# EAGLE design chanomele_main (EAGLE 6.4)
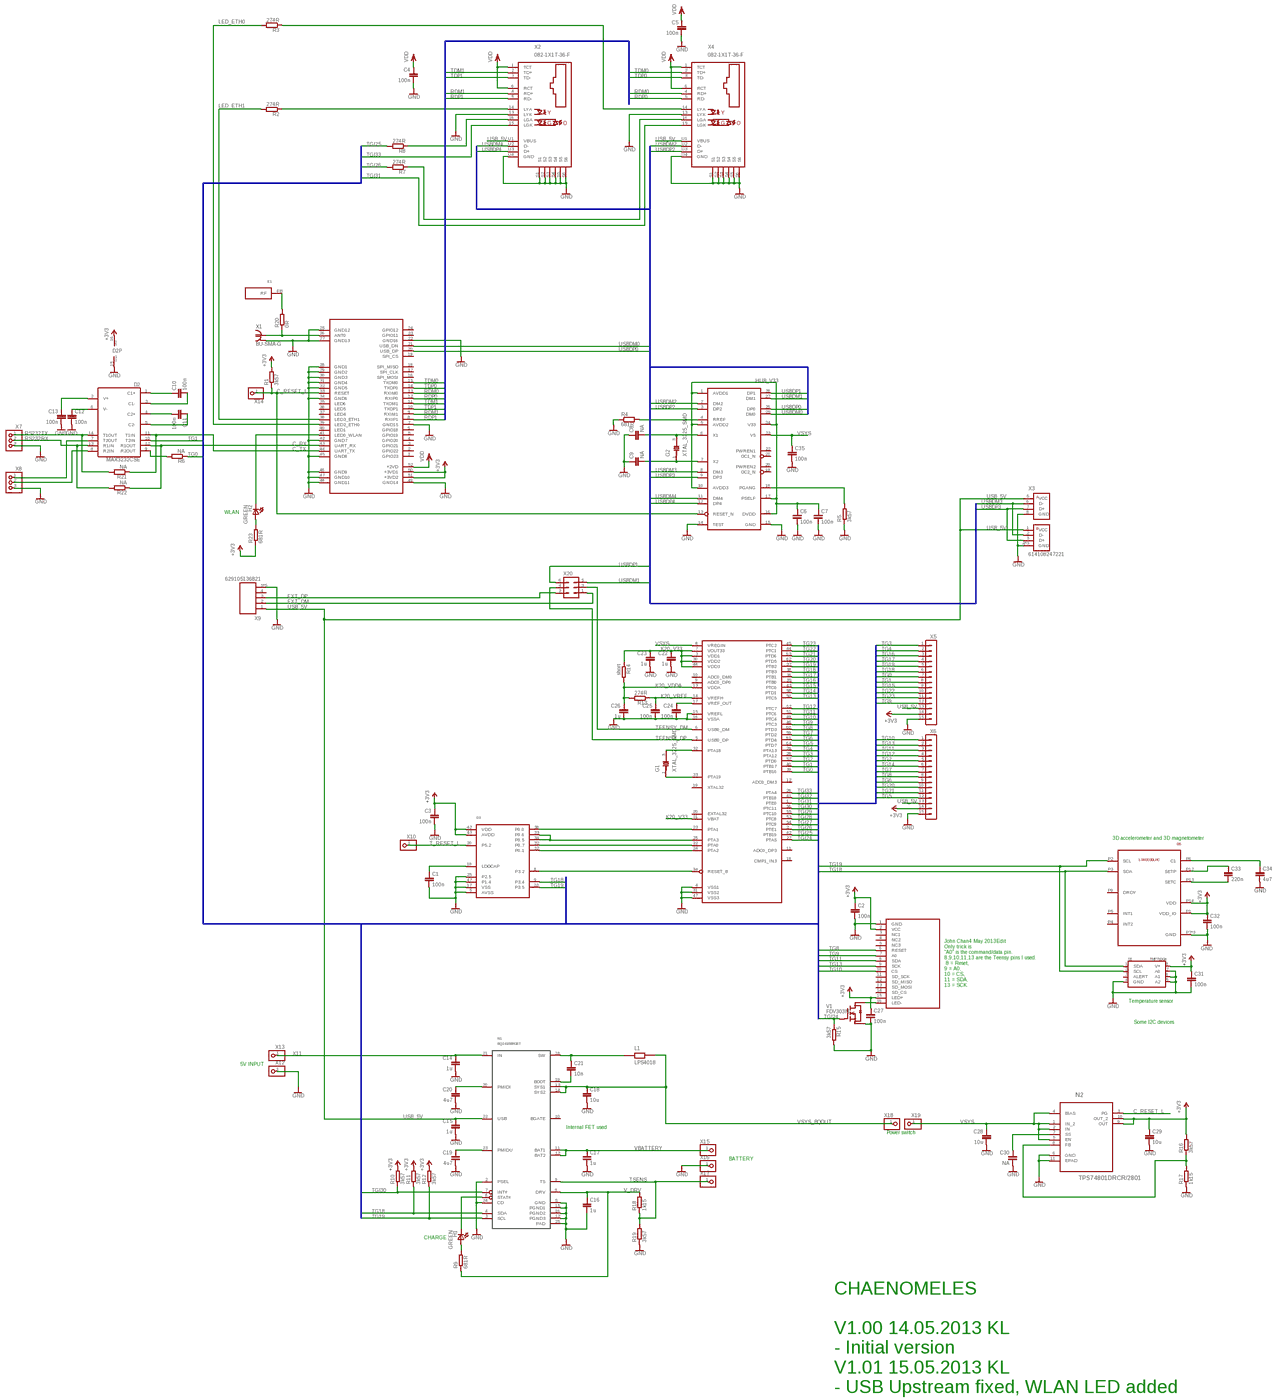
[diagram p0: schematic, sheet 1, overview]
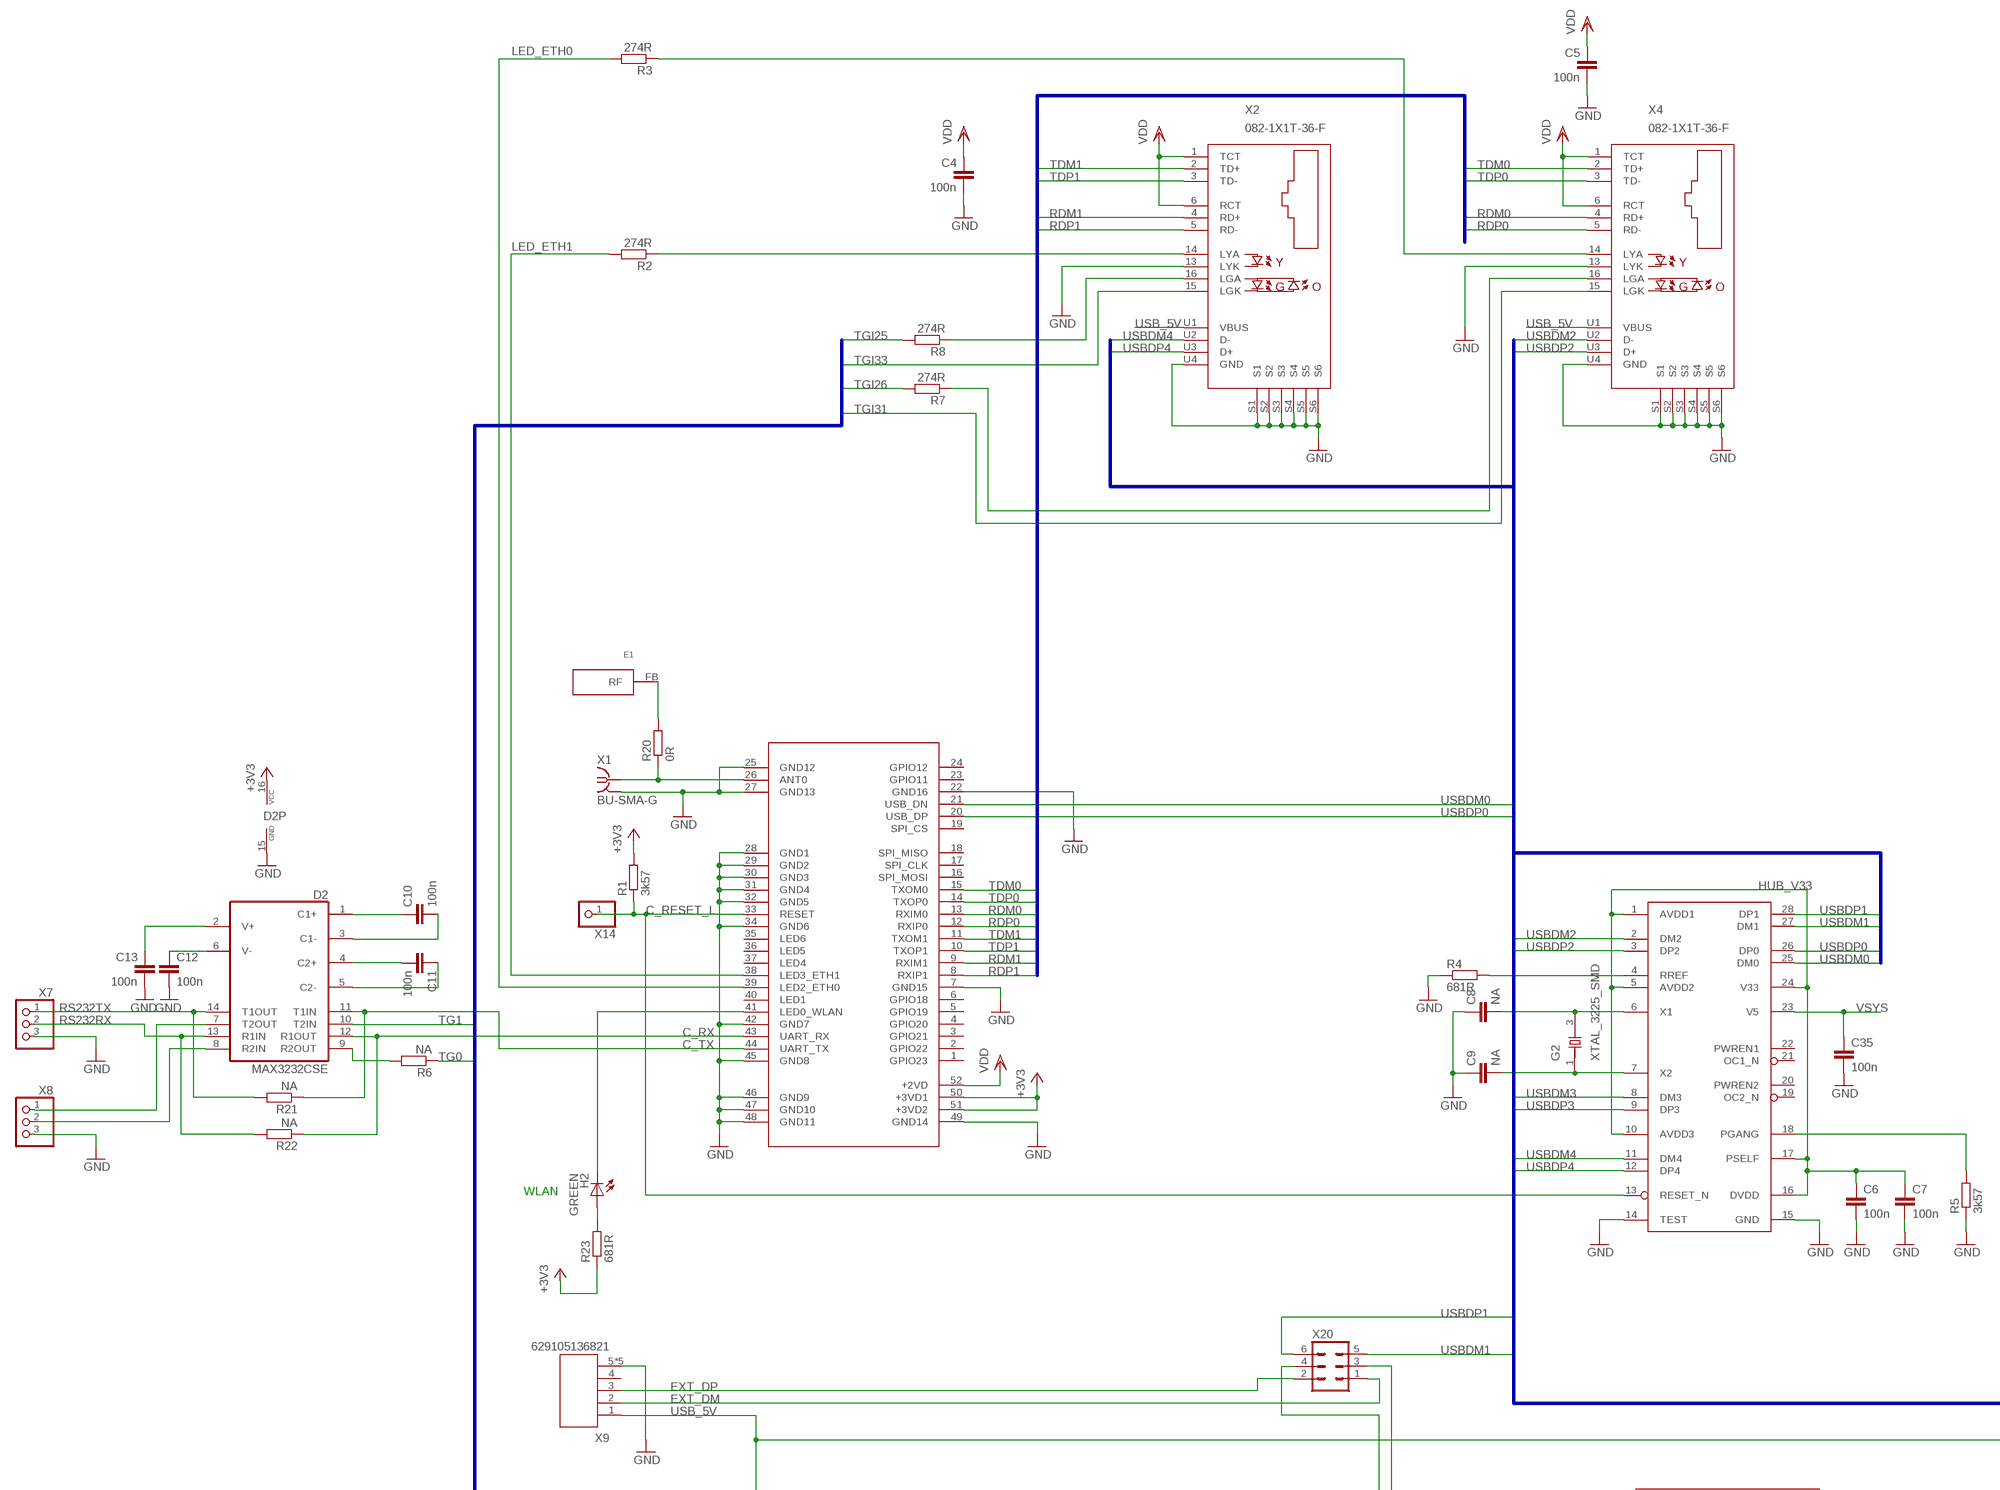
[diagram p1: schematic, sheet 1, part 1 of 4]
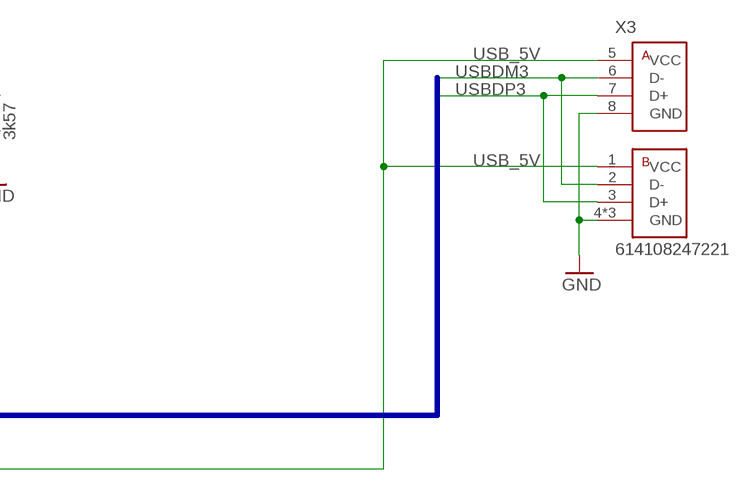
[diagram p2: schematic, sheet 1, part 2 of 4]
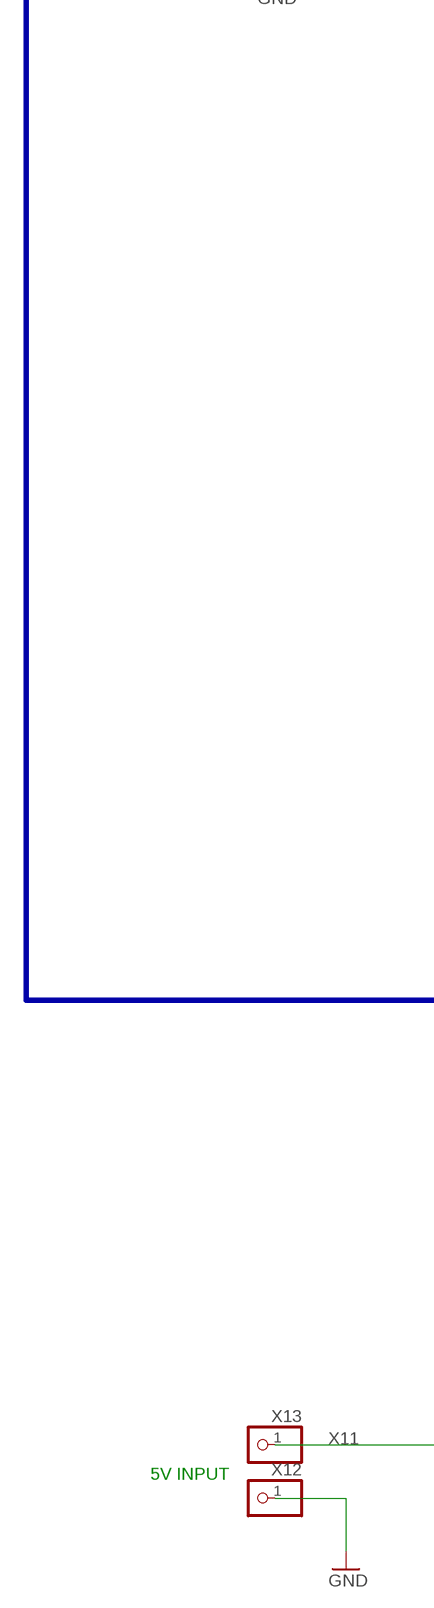
[diagram p3: schematic, sheet 1, part 3 of 4]
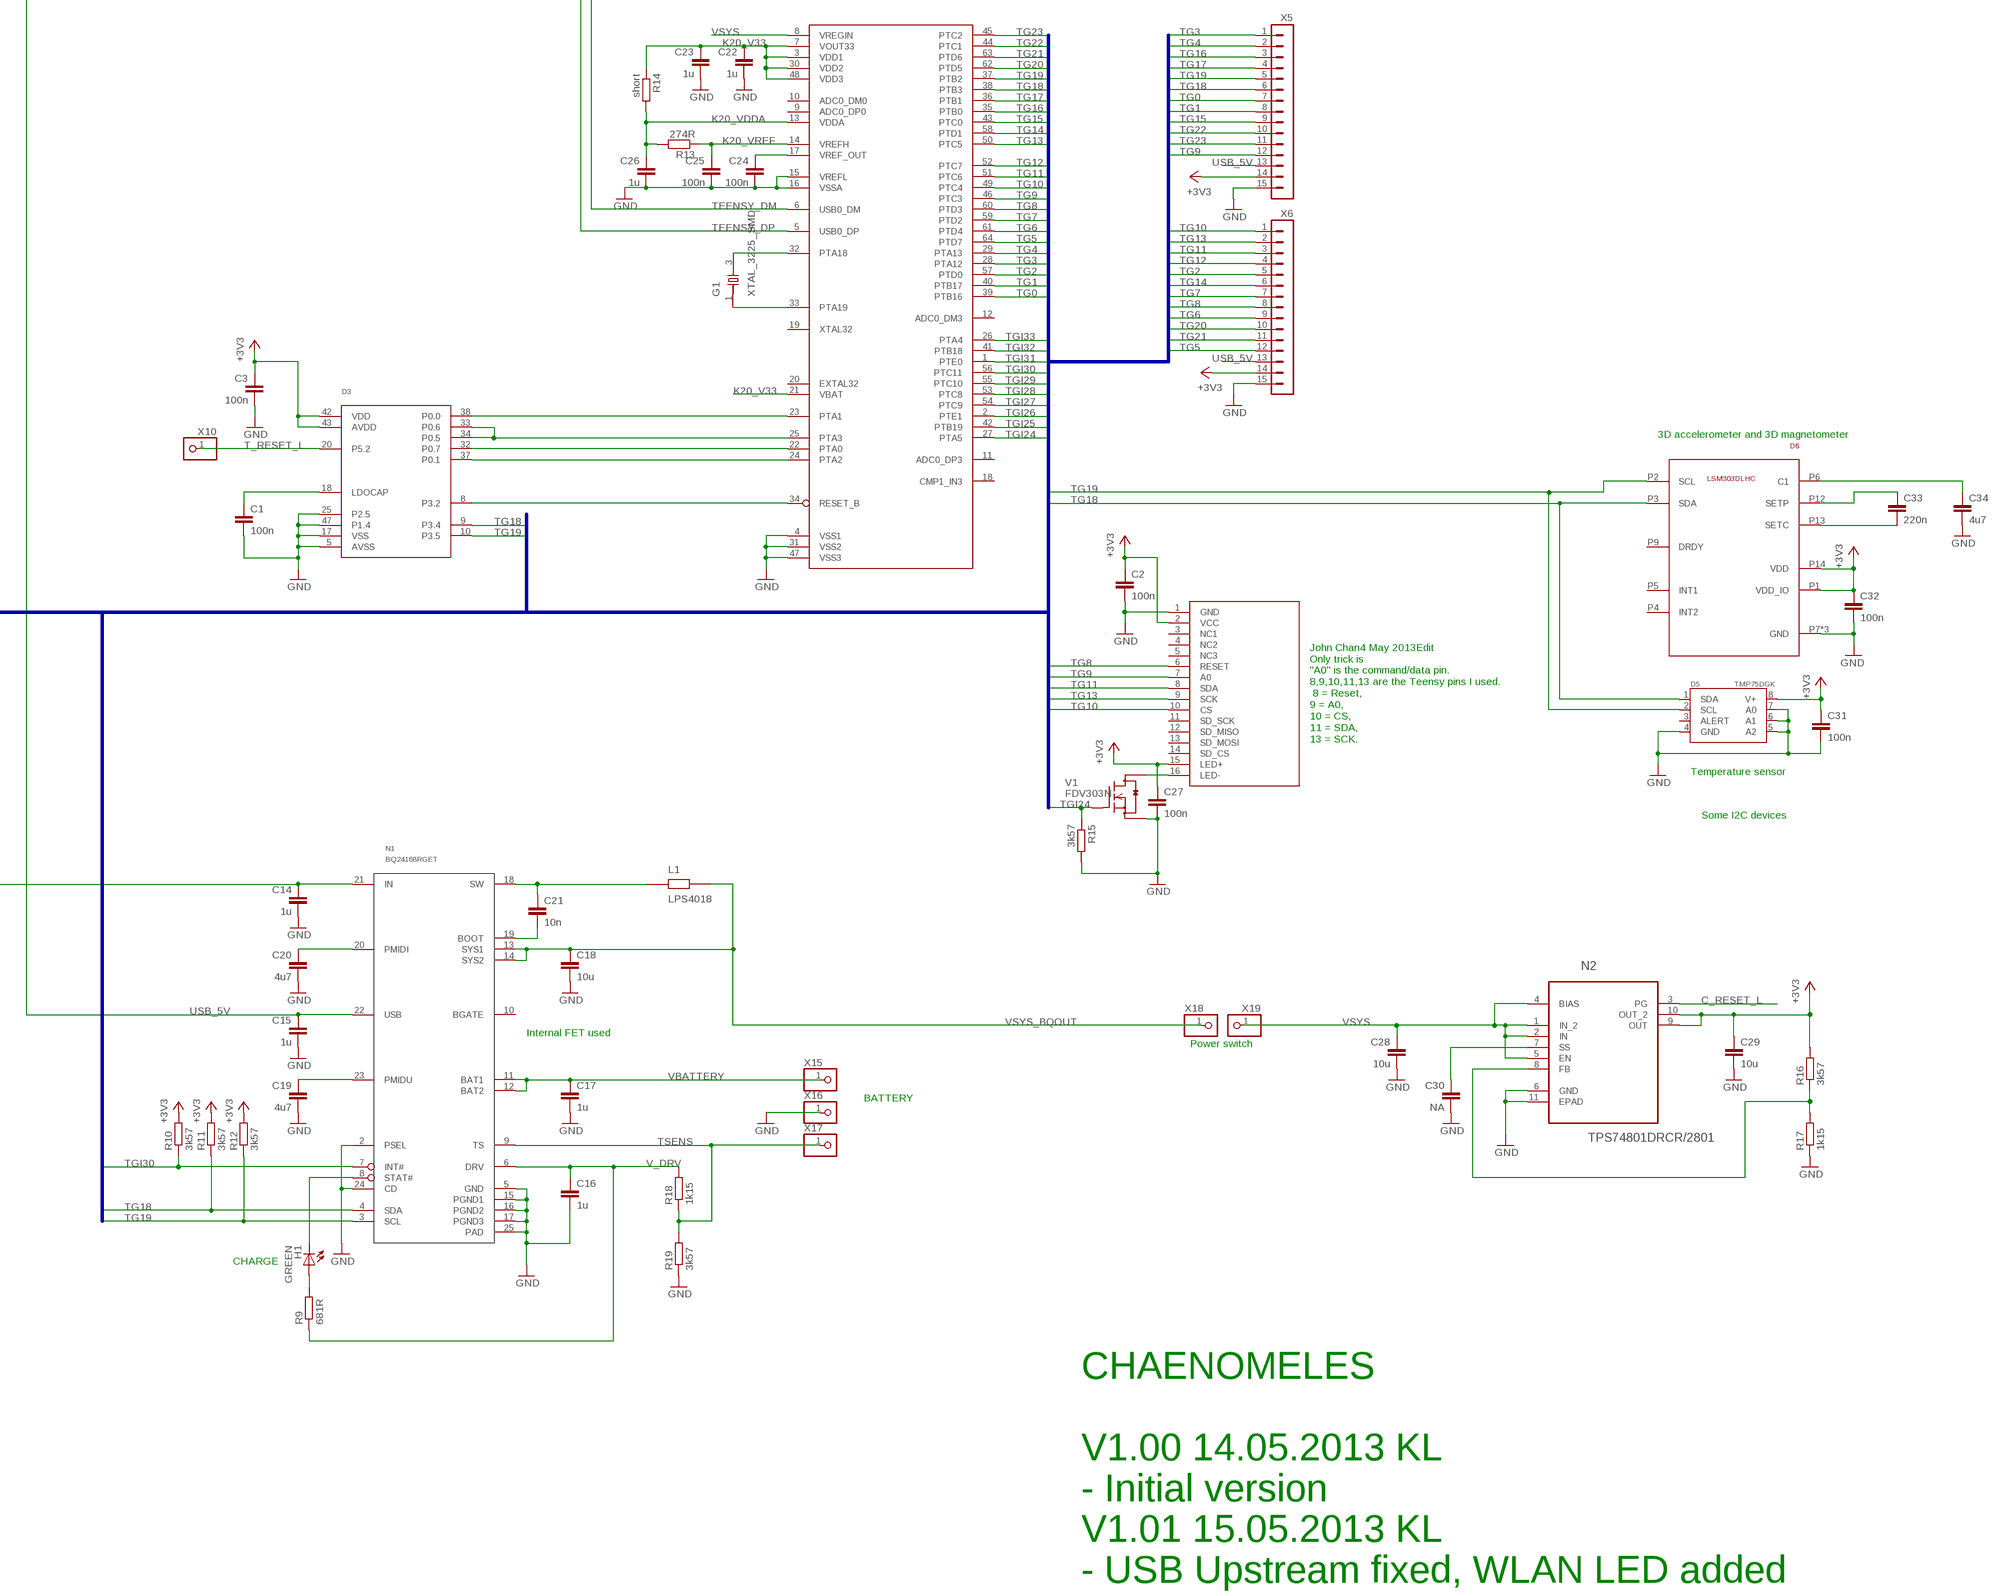
[diagram p4: schematic, sheet 1, part 4 of 4]

## Parts
A1  CARAMBOLA2  [CARAMBOLA1]
A2  TFT18  [TFT18]
C1  100n  C-EUC0402  [C0402]
C2  100n  C-EUC0402  [C0402]
C3  100n  C-EUC0402  [C0402]
C4  100n  C-EUC0402  [C0402]
C5  100n  C-EUC0402  [C0402]
C6  100n  C-EUC0402  [C0402]
C7  100n  C-EUC0402  [C0402]
C8  NA  C-EUC0402  [C0402]
C9  NA  C-EUC0402  [C0402]
C10  100n  C-EUC0402  [C0402]
C11  100n  C-EUC0402  [C0402]
C12  100n  C-EUC0402  [C0402]
C13  100n  C-EUC0402  [C0402]
C14  1u  C-EUC0603  [C0603]
C15  1u  C-EUC0603  [C0603]
C16  1u  C-EUC0603  [C0603]
C17  1u  C-EUC0603  [C0603]
C18  10u  C-EUC0805  [C0805]
C19  4u7  C-EUC0805  [C0805]
C20  4u7  C-EUC0805  [C0805]
C21  10n  C-EUC0402  [C0402]
C22  1u  C-EUC0603  [C0603]
C23  1u  C-EUC0603  [C0603]
C24  100n  C-EUC0402  [C0402]
C25  100n  C-EUC0402  [C0402]
C26  1u  C-EUC0603  [C0603]
C27  100n  C-EUC0402  [C0402]
C28  10u  C-EUC0805  [C0805]
C29  10u  C-EUC0805  [C0805]
C30  NA  C-EUC0402  [C0402]
C31  100n  C-EUC0402  [C0402]
C32  100n  C-EUC0402  [C0402]
C33  220n  C-EUC0402  [C0402]
C34  4u7  C-EUC0805  [C0805]
C35  100n  C-EUC0402  [C0402]
D1  MK20DX128VLH5  [FREESCALE_64_LQFP]
D2  MAX3232CSE  [SO16]
D3  MINI54LAN  [LQFP48-7X7]
D4  GL850G  [SSOP28DB]
D5  TMP75DGK  [MSOP8]
D6  LSM303DLHC  [LGA_3X5X1_14L]
E1  SMD_ANT_2.4GHZ  [2.4GHZ_SMD_ANTENNA]
G1  XTAL_3225_SMD  [X_3225]
G2  XTAL_3225_SMD  [X_3225]
H1  GREEN  LEDCHIP-LED0603  [CHIP-LED0603]
H2  GREEN  LEDCHIP-LED0603  [CHIP-LED0603]
L1  LPS4018  [LPS4018]
N1  BQ24168RGET  [QFN50P400X400X100-25N]
N2  TPS74801DRCR/2801  [SON50P300X300X100-11N]
R1  3k57  R-EU_R0402  [R0402]
R2  274R  R-EU_R0402  [R0402]
R3  274R  R-EU_R0402  [R0402]
R4  681R  R-EU_R0402  [R0402]
R5  3k57  R-EU_R0402  [R0402]
R6  NA  R-EU_R0402  [R0402]
R7  274R  R-EU_R0402  [R0402]
R8  274R  R-EU_R0402  [R0402]
R9  681R  R-EU_R0402  [R0402]
R10  3k57  R-EU_R0402  [R0402]
R11  3k57  R-EU_R0402  [R0402]
R12  3k57  R-EU_R0402  [R0402]
R13  274R  R-EU_R0402  [R0402]
R14  short  R-EU_R0402  [R0402]
R15  3k57  R-EU_R0402  [R0402]
R16  3k57  R-EU_R0402  [R0402]
R17  1k15  R-EU_R0402  [R0402]
R18  1k15  R-EU_R0402  [R0402]
R19  3k57  R-EU_R0402  [R0402]
R20  0R  R-EU_R0402  [R0402]
R21  NA  R-EU_R0402  [R0402]
R22  NA  R-EU_R0402  [R0402]
R23  681R  R-EU_R0402  [R0402]
V1  FDV303N  [SOT23]
X1  BU-SMA-G  [BU-SMA-G]
X2  082-1X1T-36-F  [0821-1X1T-36-F]
X3  614108247221  [614108247221]
X4  082-1X1T-36-F  [0821-1X1T-36-F]
X5  PIIKKIRIMA-15  [PIIKKIRIMA-15]
X6  PIIKKIRIMA-15  [PIIKKIRIMA-15]
X7  PINHD-1X3/90  [1X03/90]
X8  PINHD-1X3/90  [1X03/90]
X9  629105136821  [629105136821]
X10  PINHD-1X1  [1X01]
X12  PINHD-1X1  [1X01]
X13  PINHD-1X1  [1X01]
X14  PINHD-1X1  [1X01]
X15  PINHD-1X1  [1X01]
X16  PINHD-1X1  [1X01]
X17  PINHD-1X1  [1X01]
X18  PINHD-1X1  [1X01]
X19  PINHD-1X1  [1X01]
X20  MA03-2  [MA03-2]

## Nets
+3V3: A1.50(+3VD1) A1.51(+3VD2) A2.2(VCC) A2.15(LED+) C2.1 C3.1 C27.1 C29.1 C31.1 C32.1 D2.16(VCC) D3.42(VDD) D3.43(AVDD) D5.8(V+) D6.P1(VDD_IO) D6.P14(VDD) N2.9(OUT) N2.10(OUT_2) R1.2 R10.2 R11.2 R12.2 R16.2 R23.1 X5.14 X6.14
C_RESET_L: A1.33(RESET) D4.13(RESET_N) N2.3(PG) R1.1 X14.1
C_RX: A1.43(UART_RX) D2.12(R1OUT) R22.1
C_TX: A1.44(UART_TX) D2.11(T1IN) R21.1
EXT_DM: X9.2 X20.1
EXT_DP: X9.3 X20.2
EXTAL: D1.33(PTA19) G1.1(X1)
FEEDBACK: N2.8(FB) R16.1 R17.2
GND: A1.7(GND15) A1.22(GND16) A1.25(GND12) A1.27(GND13) A1.28(GND1) A1.29(GND2) A1.30(GND3) A1.31(GND4) A1.32(GND5) A1.34(GND6) A1.42(GND7) A1.45(GND8) A1.46(GND9) A1.47(GND10) A1.48(GND11) A1.49(GND14) A2.1(GND) C1.2 C2.2 C3.2 C4.2 C5.2 C6.2 C7.2 C8.1 C9.1 C12.2 C13.2 C14.2 C15.2 C16.2 C17.2 C18.2 C19.2 C20.2 C22.2 C23.2 C24.2 C25.2 C26.2 C27.2 C28.2 C29.2 C30.2 C31.2 C32.2 C34.2 C35.2 D1.4(VSS1) D1.15(VREFL) D1.16(VSSA) D1.31(VSS2) D1.47(VSS3) D2.15(GND) D3.5(AVSS) D3.17(VSS) D3.25(P2.5) D3.47(P1.4) D4.14(TEST) D4.15(GND) D5.4(GND) D5.5(A2) D5.6(A1) D5.7(A0) D6.P7(GND) D6.P10(GND) D6.P11(GND) N1.2(PSEL) N1.5(GND) N1.15(PGND1) N1.16(PGND2) N1.17(PGND3) N1.24(CD) N1.25(PAD) N2.6(GND) N2.11(EPAD) R4.1 R5.1 R15.2 R17.1 R19.1 V1.2(S) X1.2 X1.3 X1.4 X1.5 X2.13(LYK) X2.S1 X2.S2 X2.S3 X2.S4 X2.S5 X2.S6 X2.U4(GND) X3.4(GND) X3.8(GND) X3.P$1(GND) X3.P$2(GND) X4.13(LYK) X4.S1 X4.S2 X4.S3 X4.S4 X4.S5 X4.S6 X4.U4(GND) X5.15 X6.15 X7.3 X8.3 X9.5 X9.Z1 X9.Z2 X9.Z3 X9.Z4 X12.1 X16.1
HUB_V33: C6.1 C7.1 D4.1(AVDD1) D4.5(AVDD2) D4.10(AVDD3) D4.16(DVDD) D4.17(PSELF) D4.24(V33)
K20_V33: C22.1 C23.1 D1.3(VDD1) D1.7(VOUT33) D1.21(VBAT) D1.30(VDD2) D1.48(VDD3) R14.1
K20_VDDA: C26.1 D1.13(VDDA) R13.2 R14.2
K20_VREF: C25.1 D1.14(VREFH) R13.1
LED_ETH0: A1.39(LED2_ETH0) R3.2
LED_ETH1: A1.38(LED3_ETH1) R2.2
LED_WLAN: A1.41(LED0_WLAN) H2.C
N$1: D1.23(PTA1) D3.38(P0.0)
N$2: D1.25(PTA3) D3.33(P0.6) D3.34(P0.5)
N$3: A1.26(ANT0) R20.1 X1.1
N$4: C8.2 D4.6(X1) G2.3(X2)
N$5: C9.2 D4.7(X2) G2.1(X1)
N$6: E1.FB(RF) R20.2
N$8: D1.22(PTA0) D3.32(P0.7)
N$9: D1.24(PTA2) D3.37(P0.1)
N$10: D1.34(RESET_B) D3.8(P3.2)
N$11: C1.1 D3.18(LDOCAP)
N$13: R2.1 X2.14(LYA)
N$15: R3.1 X4.14(LYA)
N$16: H2.A R23.2
N$17: D4.18(PGANG) R5.2
N$18: C12.1 D2.6(V-)
N$19: C13.1 D2.2(V+)
N$20: C10.1 D2.1(C1+)
N$21: C10.2 D2.3(C1-)
N$22: C11.1 D2.5(C2-)
N$23: C11.2 D2.4(C2+)
N$24: D2.7(T2OUT) X8.1
N$25: D2.8(R2IN) X8.2
N$26: D2.9(R2OUT) R6.2
N$27: R7.1 X4.16(LGA)
N$28: R8.1 X2.16(LGA)
N$30: C20.1 N1.20(PMIDI)
N$32: C19.1 N1.23(PMIDU)
N$34: C21.2 N1.19(BOOT)
N$35: C24.1 D1.17(VREF_OUT)
N$37: C21.1 L1.A N1.18(SW)
N$38: H1.C N1.8(STAT#)
N$39: H1.A R9.2
N$57: A2.16(LED-) V1.3(D)
N$59: C34.1 D6.P6(C1)
N$60: C33.2 D6.P13(SETC)
N$61: C33.1 D6.P12(SETP)
RDM0: A1.13(RXIM0) X4.4(RD+)
RDM1: A1.9(RXIM1) X2.4(RD+)
RDP0: A1.12(RXIP0) X4.5(RD-)
RDP1: A1.8(RXIP1) X2.5(RD-)
RS232RX: D2.13(R1IN) R22.2 X7.2
RS232TX: D2.14(T1OUT) R21.2 X7.1
SS: C30.1 N2.7(SS)
T_RESET_L: D3.20(P5.2) X10.1
TDM0: A1.15(TXOM0) X4.2(TD+)
TDM1: A1.11(TXOM1) X2.2(TD+)
TDP0: A1.14(TXOP0) X4.3(TD-)
TDP1: A1.10(TXOP1) X2.3(TD-)
TEENSY_DM: D1.6(USB0_DM) X20.3
TEENSY_DP: D1.5(USB0_DP) X20.4
TG0: D1.39(PTB16) R6.1 X5.7
TG1: D1.40(PTB17) D2.10(T2IN) X5.8
TG2: D1.57(PTD0) X6.5
TG3: D1.28(PTA12) X5.1
TG4: D1.29(PTA13) X5.2
TG5: D1.64(PTD7) X6.12
TG6: D1.61(PTD4) X6.9
TG7: D1.59(PTD2) X6.7
TG8: A2.6(RESET) D1.60(PTD3) X6.8
TG9: A2.7(A0) D1.46(PTC3) X5.12
TG10: A2.10(CS) D1.49(PTC4) X6.1
TG11: A2.8(SDA) D1.51(PTC6) X6.3
TG12: D1.52(PTC7) X6.4
TG13: A2.9(SCK) D1.50(PTC5) X6.2
TG14: D1.58(PTD1) X6.6
TG15: D1.43(PTC0) X5.9
TG16: D1.35(PTB0) X5.3
TG17: D1.36(PTB1) X5.4
TG18: D1.38(PTB3) D3.9(P3.4) D5.1(SDA) D6.P3(SDA) N1.4(SDA) R11.1 X5.6
TG19: D1.37(PTB2) D3.10(P3.5) D5.2(SCL) D6.P2(SCL) N1.3(SCL) R12.1 X5.5
TG20: D1.62(PTD5) X6.10
TG21: D1.63(PTD6) X6.11
TG22: D1.44(PTC1) X5.10
TG23: D1.45(PTC2) X5.11
TGI24: D1.27(PTA5) R15.1 V1.1(G)
TGI25: D1.42(PTB19) R8.2
TGI26: D1.2(PTE1) R7.2
TGI27: D1.54(PTC9)
TGI28: D1.53(PTC8)
TGI29: D1.55(PTC10)
TGI30: D1.56(PTC11) N1.7(INT#) R10.1
TGI31: D1.1(PTE0) X4.15(LGK)
TGI32: D1.41(PTB18)
TGI33: D1.26(PTA4) X2.15(LGK)
TSENS: N1.9(TS) R18.1 R19.2 X17.1
USB_5V: C15.1 N1.22(USB) X2.U1(VBUS) X3.1(VCC) X3.5(VCC) X4.U1(VBUS) X5.13 X6.13 X9.1
USBDM0: A1.21(USB_DN) D4.25(DM0)
USBDM1: D4.27(DM1) X20.5
USBDM2: D4.2(DM2) X4.U2(D-)
USBDM3: D4.8(DM3) X3.2(D-) X3.6(D-)
USBDM4: D4.11(DM4) X2.U2(D-)
USBDP0: A1.20(USB_DP) D4.26(DP0)
USBDP1: D4.28(DP1) X20.6
USBDP2: D4.3(DP2) X4.U3(D+)
USBDP3: D4.9(DP3) X3.3(D+) X3.7(D+)
USBDP4: D4.12(DP4) X2.U3(D+)
USBREF: D4.4(RREF) R4.2
V_DRV: C16.1 N1.6(DRV) R9.1 R18.2
VBATTERY: C17.1 N1.11(BAT1) N1.12(BAT2) X15.1
VDD [VDD]: A1.52(+2VD) C4.1 C5.1 X2.1(TCT) X2.6(RCT) X4.1(TCT) X4.6(RCT)
VSYS: C28.1 C35.1 D1.8(VREGIN) D4.23(V5) N2.1(IN_2) N2.2(IN) N2.4(BIAS) N2.5(EN) X19.1
VSYS_BQOUT: C18.1 L1.B N1.13(SYS1) N1.14(SYS2) X18.1
X11: C14.1 N1.21(IN) X13.1
XTAL: D1.32(PTA18) G1.3(X2)
Unconnected: A1.1(GPIO23) A1.2(GPIO22) A1.3(GPIO21) A1.4(GPIO20) A1.5(GPIO19) A1.6(GPIO18) A1.16(SPI_MOSI) A1.17(SPI_CLK) A1.18(SPI_MISO) A1.19(SPI_CS) A1.23(GPIO11) A1.24(GPIO12) A1.35(LED6) A1.36(LED5) A1.37(LED4) A1.40(LED1) A2.3(NC1) A2.4(NC2) A2.5(NC3) A2.11(SD_SCK) A2.12(SD_MISO) A2.13(SD_MOSI) A2.14(SD_CS) D1.9(ADC0_DP0) D1.10(ADC0_DM0) D1.11(ADC0_DP3) D1.12(ADC0_DM3) D1.18(CMP1_IN3) D1.19(XTAL32) D1.20(EXTAL32) D4.19(OC2_N) D4.20(PWREN2) D4.21(OC1_N) D4.22(PWREN1) D5.3(ALERT) D6.P4(INT2) D6.P5(INT1) D6.P9(DRDY) N1.10(BGATE) X9.4

## Buses
USBDP[0..4],USBDM[0..4]
TDP0,TDM0,RDP0,RDM0,TDP1,TDM1,RDP1,RDM1
TG[0..23],TGI[24..33]

## Notes on the sheet
- WLAN
- 3D accelerometer and 3D magnetometer
- John Chan4 May 2013Edit
  Only trick is 
  "A0" is the command/data pin. 
  8,9,10,11,13 are the Teensy pins I used.
   8 = Reset, 
  9 = A0, 
  10 = CS, 
  11 = SDA, 
  13 = SCK.
- Temperature sensor
- Some I2C devices
- 5V INPUT
- Internal FET used
- Power switch
- BATTERY
- CHARGE
- CHAENOMELES
  
  V1.00 14.05.2013 KL
  - Initial version
  V1.01 15.05.2013 KL
  - USB Upstream fixed, WLAN LED added

## Library data of the parts
A1 = OMAT_IC:CARAMBOLA2
A2 = OMAT_IC:TFT18
C1-C35 = rcl:C-EU: CAPACITOR, European symbol
D1 = OMAT_IC:MK20DX128VLH5
D2 = maxim:MAX3232*: True RS-232 Transceivers 3.0V to 5.5V, Low-Power up to 1Mbps, Using Four 0.1µF External Capacitors Source: http://pdfserv.maxim-ic.com/en/ds/MAX3222-MAX3241.pdf; MPN: MAX3232CSE; OC_FARNELL: 9725490; OC_NEWARK: 90C2890
D3 = OMAT_IC:MINI54LAN
D4 = OMAT_IC:GL850G
D5 = ti_tmp:TMP75
D6 = sensors:LSM303DLHC
E1 = OMAT_IC:SMD_ANT_2.4GHZ
G1 G2 = OMAT_IC:XTAL_3225_SMD: CRYSTAL CLOCK OSCILLATORS 5.0 Vdc or 3.3 Vdc - LOW PROFILE ULTRA MINIATURE CERAMIC SURFACE MOUNT Source: http://www.abracon.com/Oscillators/asf1-L-L1.pdf
H1 H2 = led:LED: LED OSRAM: - CHIPLED LG R971, LG N971, LY N971, LG Q971, LY Q971, LO R971, LY R971 LH N974, LH R974 LS Q976, LO Q976, LY Q976 LO Q996 - Hyper CHIPLED LW Q18S LB Q993, LB Q99A, LB R99A - SideLED LS A670, LO A670, LY A670, LG A670, LP A670 LB A673, LV A673, LT A673, LW A673 LH A674 LY A675 LS A676, LA A676, LO A676, LY A676, LW A676 LS A679, LY A679, LG A679 - Hyper Micro SIDELED® LS Y876, LA Y876, LO Y876, LY Y876 LT Y87S - SmartLED LW L88C, LW L88S LB L89C, LB L89S, LG L890 LS L89K, LO L89K, LY L89K LS L896, LA L896, LO L896, LY L896 - TOPLED LS T670, LO T670, LY T670, LG T670, LP T670 LSG T670, LSP T670, LSY T670, LOP T670, LYG T670 LG T671, LOG T671, LSG T671 LB T673, LV T673, LT T673, LW T673 LH T674 LS T676, LA T676, LO T676, LY T676, LB T676, LH T676, LSB T676, LW T676 LB T67C, LV T67C, LT T67C, LS T67K, LO T67K, LY T67K, LW E67C LS E67B, LA E67B, LO E67B, LY E67B, LB E67C, LV E67C, LT E67C LW T67C LS T679, LY T679, LG T679 LS T770, LO T770, LY T770, LG T770, LP T770 LB T773, LV T773, LT T773, LW T773 LH T774 LS E675, LA E675, LY E675, LS T675 LS T776, LA T776, LO T776, LY T776, LB T776 LHGB T686 LT T68C, LB T68C - Hyper Mini TOPLED® LB M676 - Mini TOPLED Santana® LG M470 LS M47K, LO M47K, LY M47K Source: http://www.osram.convergy.de LUXEON: - LUMILED® LXK2-PW12-R00, LXK2-PW12-S00, LXK2-PW14-U00, LXK2-PW14-V00 LXK2-PM12-R00, LXK2-PM12-S00, LXK2-PM14-U00 LXK2-PE12-Q00, LXK2-PE12-R00, LXK2-PE12-S00, LXK2-PE14-T00, LXK2-PE14-U00 LXK2-PB12-K00, LXK2-PB12-L00, LXK2-PB12-M00, LXK2-PB14-N00, LXK2-PB14-P00, LXK2-PB14-Q00 LXK2-PR12-L00, LXK2-PR12-M00, LXK2-PR14-Q00, LXK2-PR14-R00 LXK2-PD12-Q00, LXK2-PD12-R00, LXK2-PD12-S00 LXK2-PH12-R00, LXK2-PH12-S00 LXK2-PL12-P00, LXK2-PL12-Q00, LXK2-PL12-R00 Source: www.luxeon.com KINGBRIGHT: KA-3528ASYC Source: www.kingbright.com
L1 = OMAT_IC:LPS4018: Coilcraft Shielded SMT power inductor 15uH inductor for LM2842 switching regulator application circuit.; DATASHEET: http://www.coilcraft.com/pdf_viewer/showpdf.cfm?f=pdf_store:lps4018.pdf; LINK: http://www.coilcraft.com/lps4018.cfm; MFGPN: LPS4018-153MLB
N1 = OMAT_IC:BQ24168RGET
N2 = Texas Instruments_By_element14_Batch_1:TPS74801DRCR/2801: 1.5A Low-Dropout Linear Regulator with Programmable Soft-Start; MPN: TPS74801DRCR/2801; OC_FARNELL: -; OC_NEWARK: 55R7658; PACKAGE: SON-10; SUPPLIER: Texas Instruments
R1-R23 = rcl:R-EU_: RESISTOR, European symbol
V1 = fairchild:FDV303N
X1 = con-coax:BU-SMA-G: FEMALE SMA CONNECTOR Radiall distributor RS 193-9117; OC_FARNELL: unknown; OC_NEWARK: unknown
X2 X4 = OMAT_IC:082-1X1T-36-F: Ethernet Connector MagJack (R) Source: www.stewartconnector.com .. si-50170.pdf; OC_FARNELL: unknown; OC_NEWARK: unknown
X3 = OMAT_IC:614108247221: WR-COM USB Dual way Horizontal Type A
X5 X6 = OMAT_IC:PIIKKIRIMA-15: PIN HEADER; OC_FARNELL: unknown; OC_NEWARK: unknown
X7 X8 = pinhead:PINHD-1X3: PIN HEADER
X9 = OMAT_IC:629105136821: WR-COM SMT Horizontal 5 Contacts Micro USB Type B,5 pins
X10 X12-X19 = pinhead:PINHD-1X1: PIN HEADER
X20 = con-lstb:MA03-2: PIN HEADER; OC_FARNELL: unknown; OC_NEWARK: unknown

## Net classes
1 VDD: width 0.75 mm, drill 0.3 mm, clearance 0.15 mm

## Board
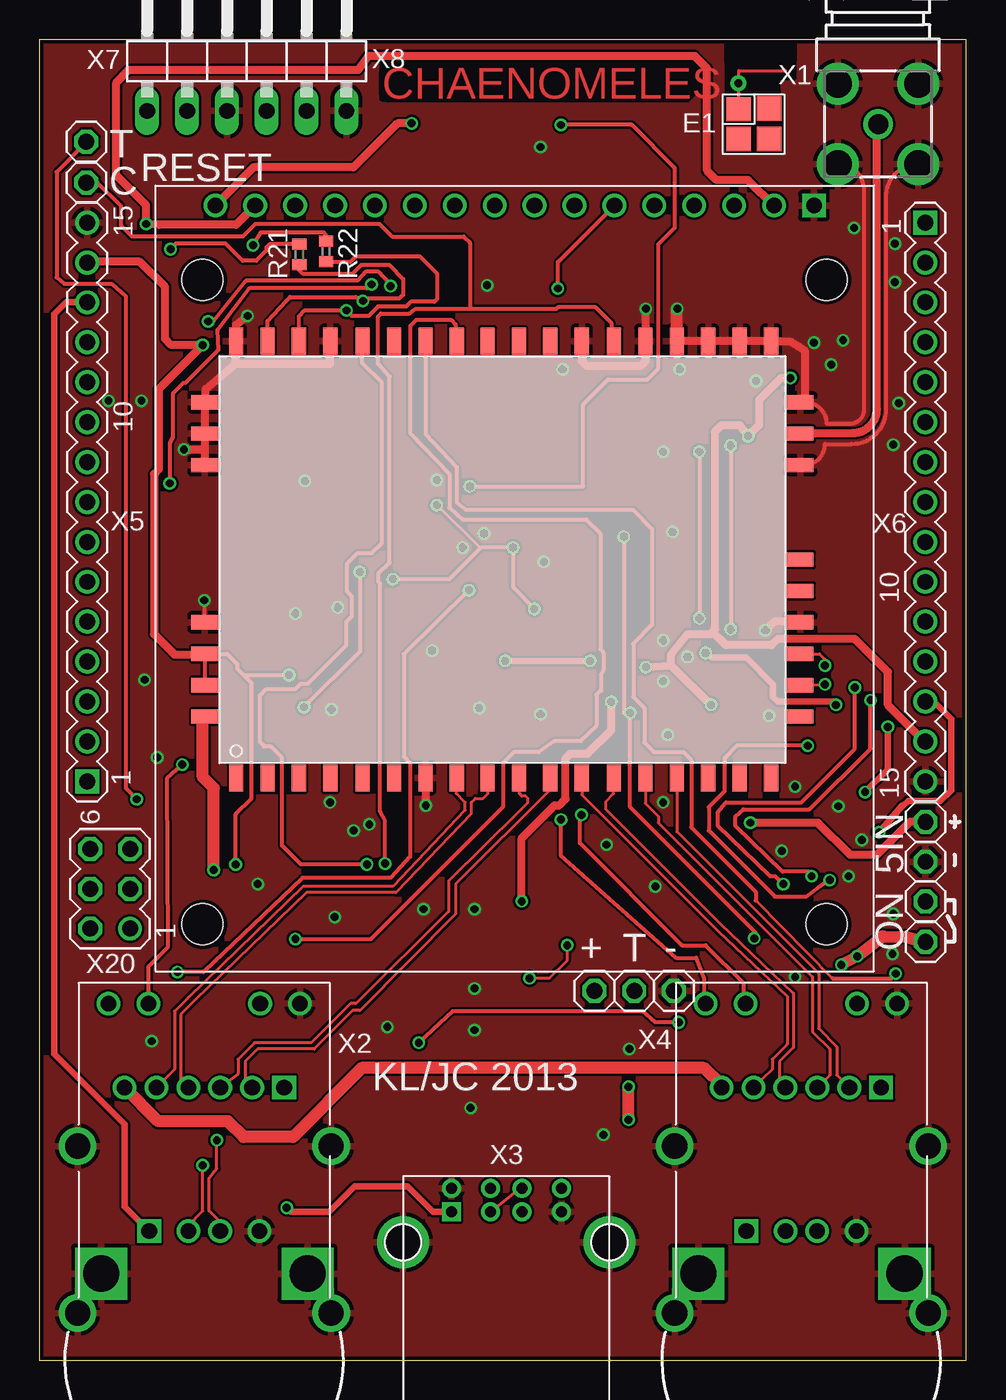
[diagram p5: board, top side]
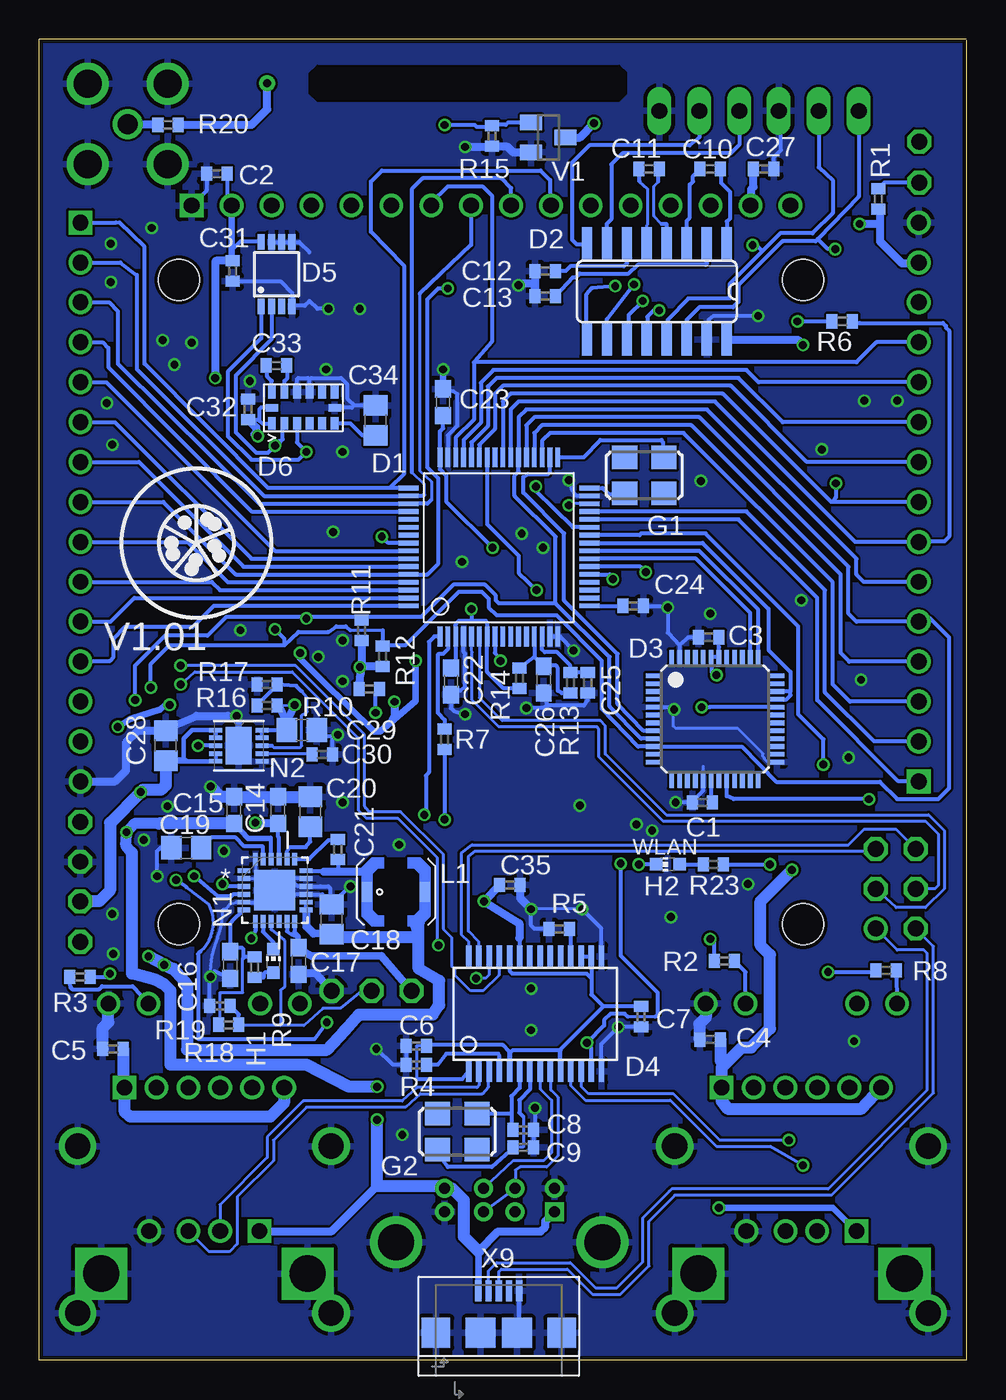
[diagram p6: board, bottom side, seen from below]

Size 59 x 84.05 mm. Coordinates in mm from the lower left corner, seen from the top.
Outline: 0,84 0,0 59,0 59,84.05 0,84.05
Copper layers (1*16): Top 0.035mm / dielectric 1.5mm / Bottom 0.035mm
Design rules "ITEADstudio_DRC": minimum track width 6mil, minimum drill 12mil, track to track 6mil, track to pad 6mil, pad to pad 6mil, via to via 6mil, smd to smd 0mil, copper to edge 10mil, drill to drill 10mil, minimum pad ring 10mil, minimum via ring 6mil, stop-mask expansion 2mil, vias tented up to drill 100mil, thermal gap 10mil
tRestrict: area 21.7,80.2 to 41.8,82.3; 5 lines
bRestrict: area 21.7,80.2 to 41.8,82.3

### Footprints (pad centres in the part's own frame; a part is rotated, then mirrored left to right if it is on the bottom)
CARAMBOLA1 = smd 0.9 x 1.7: 1 2,-23.9; 2 4,-23.9; 3 6,-23.9; 4 8,-23.9; 5 10.05,-23.9; 6 12.05,-23.9; 7 14.05,-23.9; 8 16.05,-23.9; 9 18,-23.9; 10 20,-23.9; 11 22,-23.9; 12 24,-23.9; 13 26.05,-23.9; 14 28.05,-23.9; 15 30.05,-23.9; 16 32.05,-23.9; 17 34.05,-23.9; 18 36.05,-23.9; 28 36.05,3.9; 29 34.05,3.9; 30 32.05,3.9; 31 30.05,3.9; 32 28.05,3.9; 33 26.05,3.9; 34 24,3.9; 35 22,3.9; 36 20,3.9; 37 18,3.9; 38 16.05,3.9; 39 14.05,3.9; 40 12.05,3.9; 41 10.05,3.9; 42 8,3.9; 43 6,3.9; 44 4,3.9; 45 2,3.9 | smd 1.7 x 0.9: 19 37.9,-20; 20 37.9,-18; 21 37.9,-16; 22 37.9,-14; 23 37.9,-12; 24 37.9,-10; 25 37.9,-4; 26 37.9,-2; 27 37.9,0; 46 0,0; 47 0,-2; 48 0,-4; 49 0,-14; 50 0,-16; 51 0,-18; 52 0,-20
TFT18 = drill 1 square: 1 -10.16,-5.08 | drill 1: 2 -7.62,-5.08; 3 -5.08,-5.08; 4 -2.54,-5.08; 5 0,-5.08; 6 2.54,-5.08; 7 5.08,-5.08; 8 7.62,-5.08; 9 10.16,-5.08; 10 12.7,-5.08; 11 15.24,-5.08; 12 17.78,-5.08; 13 20.32,-5.08; 14 22.86,-5.08; 15 25.4,-5.08; 16 27.94,-5.08 | hole 2.6: -10.97,-0.35; 28.75,-0.35; -10.97,40.65; 28.75,40.65
C0402 = smd 0.7 x 0.9: 1 -0.65,0; 2 0.65,0
C0603 = smd 1.1 x 1: 1 -0.85,0; 2 0.85,0
C0805 = smd 1.3 x 1.5: 1 -0.95,0; 2 0.95,0
FREESCALE_64_LQFP = smd 1.27 x 0.3: 1 -15.9,9; 2 -15.9,8.5; 3 -15.9,8; 4 -15.9,7.5; 5 -15.9,7; 6 -15.9,6.5; 7 -15.9,6; 8 -15.9,5.5; 9 -15.9,5; 10 -15.9,4.5; 11 -15.9,4; 12 -15.9,3.5; 13 -15.9,3; 14 -15.9,2.5; 15 -15.9,2; 16 -15.9,1.5; 33 -4.5,1.5; 34 -4.5,2; 35 -4.5,2.5; 36 -4.5,3; 37 -4.5,3.5; 38 -4.5,4; 39 -4.5,4.5; 40 -4.5,5; 41 -4.5,5.5; 42 -4.5,6; 43 -4.5,6.5; 44 -4.5,7; 45 -4.5,7.5; 46 -4.5,8; 47 -4.5,8.5; 48 -4.5,9 | smd 0.3 x 1.27: 17 -13.95,-0.5; 18 -13.45,-0.5; 19 -12.95,-0.5; 20 -12.45,-0.5; 21 -11.95,-0.5; 22 -11.45,-0.5; 23 -10.95,-0.5; 24 -10.45,-0.5; 25 -9.95,-0.5; 26 -9.45,-0.5; 27 -8.95,-0.5; 28 -8.45,-0.5; 29 -7.95,-0.5; 30 -7.45,-0.5; 31 -6.95,-0.5; 32 -6.45,-0.5; 49 -6.45,11; 50 -6.95,11; 51 -7.45,11; 52 -7.95,11; 53 -8.45,11; 54 -8.95,11; 55 -9.45,11; 56 -9.95,11; 57 -10.45,11; 58 -10.95,11; 59 -11.45,11; 60 -11.95,11; 61 -12.45,11; 62 -12.95,11; 63 -13.45,11; 64 -13.95,11
SO16 = smd 0.66 x 2.032: 1 -4.445,-3.073; 2 -3.175,-3.073; 3 -1.905,-3.073; 4 -0.635,-3.073; 5 0.635,-3.073; 6 1.905,-3.073; 7 3.175,-3.073; 8 4.445,-3.073; 9 4.445,3.073; 10 3.175,3.073; 11 1.905,3.073; 12 0.635,3.073; 13 -0.635,3.073; 14 -1.905,3.073; 15 -3.175,3.073; 16 -4.445,3.073
LQFP48-7X7 = smd 0.9 x 0.3: 1 -3.95,2.75; 2 -3.95,2.25; 3 -3.95,1.75; 4 -3.95,1.25; 5 -3.95,0.75; 6 -3.95,0.25; 7 -3.95,-0.25; 8 -3.95,-0.75; 9 -3.95,-1.25; 10 -3.95,-1.75; 11 -3.95,-2.25; 12 -3.95,-2.75; 25 3.95,-2.75; 26 3.95,-2.25; 27 3.95,-1.75; 28 3.95,-1.25; 29 3.95,-0.75; 30 3.95,-0.25; 31 3.95,0.25; 32 3.95,0.75; 33 3.95,1.25; 34 3.95,1.75; 35 3.95,2.25; 36 3.95,2.75 | smd 0.3 x 0.9: 13 -2.75,-3.95; 14 -2.25,-3.95; 15 -1.75,-3.95; 16 -1.25,-3.95; 17 -0.75,-3.95; 18 -0.25,-3.95; 19 0.25,-3.95; 20 0.75,-3.95; 21 1.25,-3.95; 22 1.75,-3.95; 23 2.25,-3.95; 24 2.75,-3.95; 37 2.75,3.95; 38 2.25,3.95; 39 1.75,3.95; 40 1.25,3.95; 41 0.75,3.95; 42 0.25,3.95; 43 -0.25,3.95; 44 -0.75,3.95; 45 -1.25,3.95; 46 -1.75,3.95; 47 -2.25,3.95; 48 -2.75,3.95
SSOP28DB = smd 0.348 x 1.397: 1 -4.225,-3.656; 2 -3.575,-3.656; 3 -2.925,-3.656; 4 -2.275,-3.656; 5 -1.625,-3.656; 6 -0.975,-3.656; 7 -0.325,-3.656; 8 0.325,-3.656; 9 0.975,-3.656; 10 1.625,-3.656; 11 2.275,-3.656; 12 2.925,-3.656; 13 3.575,-3.656; 14 4.225,-3.656; 15 4.225,3.656; 16 3.575,3.656; 17 2.925,3.656; 18 2.275,3.656; 19 1.625,3.656; 20 0.975,3.656; 21 0.325,3.656; 22 -0.325,3.656; 23 -0.975,3.656; 24 -1.625,3.656; 25 -2.275,3.656; 26 -2.925,3.656; 27 -3.575,3.656; 28 -4.225,3.656
MSOP8 = smd 0.45 x 1: 1 -0.975,-2.05; 2 -0.325,-2.05; 3 0.325,-2.05; 4 0.975,-2.05; 5 0.975,2.05; 6 0.325,2.05; 7 -0.325,2.05; 8 -0.975,2.05
LGA_3X5X1_14L = smd 0.5 x 0.8: P1 -2,-1; P2 -1.2,-1; P3 -0.4,-1; P4 0.4,-1; P5 1.2,-1; P6 2,-1; P8 2,1; P9 1.2,1; P10 0.4,1; P11 -0.4,1; P12 -1.2,1; P13 -2,1 | smd 0.8 x 0.5: P7 2,0; P14 -2,0
2.4GHZ_SMD_ANTENNA = smd 1.54 x 1.54: 1 0.04,0; 2 1.94,0; 3 1.94,1.94; 4 0,1.94 | drill 0.5: FB -1.6,0
X_3225 = smd 1.6 x 1.5: 1 -1.25,-1.15; 2 1.25,-1.15; 3 1.25,1.15; 4 -1.25,1.15
CHIP-LED0603 = smd 0.8 x 0.8: A 0,-0.75; C 0,0.75
LPS4018 = smd 0.635 x 1.27: A -1.85,0; B 1.85,0
QFN50P400X400X100-25N = smd 0.813 x 0.305: 1 -1.981,1.245; 2 -1.981,0.762; 3 -1.981,0.254; 4 -1.981,-0.254; 5 -1.981,-0.762; 6 -1.981,-1.245; 13 1.981,-1.245; 14 1.981,-0.762; 15 1.981,-0.254; 16 1.981,0.254; 17 1.981,0.762; 18 1.981,1.245 | smd 0.305 x 0.813: 7 -1.245,-1.981; 8 -0.762,-1.981; 9 -0.254,-1.981; 10 0.254,-1.981; 11 0.762,-1.981; 12 1.245,-1.981; 19 1.245,1.981; 20 0.762,1.981; 21 0.254,1.981; 22 -0.254,1.981; 23 -0.762,1.981; 24 -1.245,1.981 | smd 2.591 x 2.591: 25 -0.025,0
SON50P300X300X100-11N = smd 0.813 x 0.305: 1 -1.473,0.991; 2 -1.473,0.508; 3 -1.473,0; 4 -1.473,-0.508; 5 -1.473,-0.991; 6 1.473,-0.991; 7 1.473,-0.508; 8 1.473,0; 9 1.473,0.508; 10 1.473,0.991 | smd 1.651 x 2.388: 11 0,0
R0402 = smd 0.7 x 0.9: 1 -0.65,0; 2 0.65,0
SOT23 = smd 1 x 1.4: 1 -0.95,-1.1; 2 0.95,-1.1; 3 0,1.1
BU-SMA-G = drill 1.27: 1 0,0 | drill 1.778: 2 -2.55,2.55; 3 2.55,2.55; 4 2.55,-2.55; 5 -2.55,-2.55
0821-1X1T-36-F = drill 1 square: 1 5.075,14.35; U1 -3.505,5.21 | drill 1: 2 3.045,14.35; 3 1.015,14.35; 4 -1.015,14.35; 5 -3.045,14.35; 6 -5.075,14.35; 13 6.09,19.69; 14 3.55,19.69; 15 -3.55,19.69; 16 -6.09,19.69; U2 -1.005,5.21; U3 1.005,5.21; U4 3.505,5.21 | drill 1.6: S1 -8.065,10.62; S2 8.065,10.62; S5 -8.065,0; S6 8.065,0 | drill 2.3 square: S3 -6.565,2.51; S4 6.565,2.51
614108247221 = drill 0.7 square: 1 4.5,0 | drill 0.7: 2 2,0; 3 0,0; 4 -2.5,0; 5 -2.5,-1.5; 6 0,-1.5; 7 2,-1.5; 8 4.5,-1.5 | drill 2.3: P$1 -5.57,1.93; P$2 7.57,1.93
PIIKKIRIMA-15 = drill 1.016 square: 1 -24.13,0 | drill 1.016: 2 -21.59,0; 3 -19.05,0; 4 -16.51,0; 5 -13.97,0; 6 -11.43,0; 7 -8.89,0; 8 -6.35,0; 9 -3.81,0; 10 -1.27,0; 11 1.27,0; 12 3.81,0; 13 6.35,0; 14 8.89,0; 15 11.43,0
1X03/90 = drill 1.016 long: 1 -2.54,-3.81; 2 0,-3.81; 3 2.54,-3.81
629105136821 = smd 0.4 x 1.35: 1 -1.3,0; 2 -0.65,0; 3 0,0; 4 0.65,0; 5 1.3,0 | smd 1.8 x 1.9: Z1 -4,-2.675; Z4 4,-2.675 | smd 1.9 x 1.9: Z2 -1.15,-2.675; Z3 1.15,-2.675
1X01 = drill 1.016 octagon: 1 0,0
MA03-2 = drill 1.016: 1 -2.54,-1.27 | drill 1.016 octagon: 2 -2.54,1.27; 3 0,-1.27; 4 0,1.27; 5 2.54,-1.27; 6 2.54,1.27

### Placement (x,y rotation side)
A1  10.52,60.95 0 top
A2  39.14,68.39 180 top
C1  16.8,35.5 180 bottom
C2  47.7,75.5 180 bottom
C3  16.4,46 180 bottom
C4  16.3,20.4 180 bottom
C5  54.3,19.8 180 bottom
C6  35,20 180 bottom
C7  20.7,21.85 270 bottom
C8  28.2,14.65 180 bottom
C9  28.2,13.55 180 bottom
C10  16.3,75.8 180 bottom
C11  20.2,75.8 0 bottom
C12  26.8,69.3 180 bottom
C13  26.8,67.7 180 bottom
C14  43.8,35 90 bottom
C15  46.6,35 90 bottom
C16  46.85,25.15 270 bottom
C17  42.5,25.4 270 bottom
C18  40.4,28.05 90 bottom
C19  49.65,32.6 180 bottom
C20  41.75,34.9 90 bottom
C21  40,32.5 90 bottom
C22  32.8,43.2 270 bottom
C23  33.3,60.95 90 bottom
C24  21.2,48 0 bottom
C25  24.1,43.1 270 bottom
C26  26.9,43.3 270 bottom
C27  12.9,75.8 0 bottom
C28  50.95,39.1 90 bottom
C29  42.3,40.1 0 bottom
C30  41,38.55 0 bottom
C31  46.7,69.3 270 bottom
C32  45.7,60.5 90 bottom
C33  43.9,63.3 180 bottom
C34  37.6,59.8 90 bottom
C35  29.05,30.25 0 bottom
D1  24.5,61.95 90 bottom
D2  19.7,68 180 bottom
D3  16,40.8 0 bottom
D4  27.45,22.05 0 bottom
D5  43.9,69.1 0 bottom
D6  42.2,60.6 0 bottom
E1  44.5,79.65 270 top
G1  20.5,56.3 180 bottom
G2  32.4,14.55 0 bottom
H1  44.1,25.4 0 bottom
H2  19,31.55 90 bottom
L1  36.3,29.8 0 bottom
N1  44,29.9 0 bottom
N2  46.3,39.1 0 bottom
R1  5.6,73.9 270 bottom
R2  15.4,25.4 180 bottom
R3  56.4,24.4 0 bottom
R4  35,18.8 0 bottom
R5  25.9,27.45 0 bottom
R6  7.9,66.1 180 bottom
R7  33.2,39.5 90 bottom
R8  5.1,24.8 180 bottom
R9  45.3,25 270 bottom
R10  38,42.7 180 bottom
R11  38.5,46.45 270 bottom
R12  37.15,44.8 270 bottom
R13  25.2,43.1 270 bottom
R14  28.45,43.4 90 bottom
R15  30.2,77.9 270 bottom
R16  44.5,41.65 0 bottom
R17  44.5,43 0 bottom
R18  46.95,21.35 180 bottom
R19  47.5,22.55 0 bottom
R20  50.8,78.6 0 bottom
R21  16.55,70.35 90 top
R22  18.25,70.55 90 top
R23  16.1,31.55 180 bottom
V1  26.6,77.8 270 bottom
X1  53.38,78.66 90 top
X2  10.5,3 0 top
X3  30.72,9.43 180 top
X4  48.5,3 0 top
X5  3.04,60.96 90 top
X6  56.38,48.26 270 top
X7  9.4,83.3 0 top
X8  17,83.3 0 top
X9  29.76,4.42 0 bottom
X10  3,77.54 0 top
X12  56.4,31.72 0 top
X13  56.4,34.26 0 top
X14  3,74.94 0 top
X15  35.32,23.5 0 top
X16  40.4,23.5 0 top
X17  37.86,23.5 0 top
X18  56.4,26.62 0 top
X19  56.4,29.18 0 top
X20  4.5,30 90 top

### Tracks (layer width: path | path; a pad name or v marks a point on that pad's centre or on a via)
+3V3  (via drill 0.5)
  Top 0.25: A1.51 A1.50 11.95,44.95 12.6,44.3 12.6,44 13,43.6 | 13,43.6 v15.9,43.6 | v12.5,31.55 12.5,34.75 13.5,35.75 13.5,43.1 13,43.6
  Top 0.5: A2.15 12.52,72.25 7.65,72.25 v6.8,72.3 6.8,73.5 4.9,75.4 4.9,81.3 5.7,82.1 20.3,82.1 20.95,83 41.7,83 42.5,82.2 42.5,75.7 43.1,75.1 45.1,75.1 46.8,73.4 46.8,73.43 A2.2 | v10.4,64.6 8.4,64.6 8,65 8,68.3 6.4,69.9 3.09,69.9 X5.14 | v38.6,44.1 40.2,44.2 | 40.2,44.2 v42.75,41.7 | v47.8,62.5 47.2,62.5 45.8,61.1 45.8,59.5 v45.1,58.8 44.6,59.5 43.4,59.5 43,59.1 43,46.5 42.85,46.35 | 40.2,44.2 40.2,44.9 41.25,46.2 42.7,46.2 42.85,46.35 | 42.85,46.35 43.7,45.5 46.6,45.5 47,45.9 51.9,45.9 54,43.8 54,41.7 56.33,39.37 X6.14 | 10.4,64.7 v10.4,64.6 | v10.4,64.6 7.6,61.8 7.6,56.7 7.3,56.4 7.3,46.2 8.6,44.9 10.47,44.9 A1.50
  Bottom 0.2: R16.2 43.1,41.7 v42.75,41.7 | 43.4,40.95 43.35,41 43.26,40.64 C29.1
  Bottom 0.25: 5.5,72.3 5.5,73.2 5.55,73.25 R1.2 5.65,73.25 5.5,73.3 | 3.09,69.8 X5.14 | C2.1 47.05,73.76 A2.2 | C3.1 15.9,45.95 15.9,46 15.8,46 15.75,45.35 D3.42 D3.43 16.2,44.7 16.2,43.8 16,43.6 v15.9,43.6 | N2.9 N2.10 C29.1 | C31.1 46.7,70.7 46.2,71.2 44.92,71.2 D5.8 | D6.P14 44.9,60.6 45,60.5 45,59.8 | 45,59.8 44.8,59.6 D6.P1 | C32.1 45.05,59.85 45,59.8 | R23.1 v12.5,31.55
  Bottom 0.4: A2.2 46.76,70.01 C31.1
  Bottom 0.5: 5.5,72.3 5.5,71.2 4.1,69.8 3.09,69.8 | D2.16 10.73,64.93 v10.4,64.6 | A2.15 13.7,73.51 13.7,74.5 13.55,74.65 C27.1 | 5.5,73.3 5.5,72.3 | 5.5,72.3 v6.8,72.3 | 38.5,44.15 R12.2 38.45,44.15 38.5,44.2 | R10.2 38.55,43.7 38.5,44.15 | R11.2 38.5,44.15 | 38.5,44.15 v38.6,44.1 | v42.75,41.7 43.26,40.64 43.67,41.52 | C31.1 47.75,69.95 47.8,69.9 v47.8,62.5 | C32.1 45.2,59.35 v45.1,58.8 45.1,59 45.2,59 45.3,58.9
C_RESET_L  (via drill 0.5)
  Top 0.25: A1.33 36.4,65.02 36.4,66 35.4,67 33,67 32.9,66.9 27.35,66.9 | v22,31.6 22,34.3 21.7,34.9 21.7,49.4 21.6,49.5 21.6,50.1 22.3,50.75 22.3,62.6 21.55,63.4 21.55,66.4 21.75,66.6 23.55,66.6 23.95,66.9 27.35,66.9 | v48.9,39.1 44.4,39.1 43.6,38.3 43.6,36.2 42.6,35.2 42.6,33.7 46.8,29.5 48.8,29.5 49.6,30.1 v50.3,30.55 | v40.7,21.5 39.2,21.5 38.4,22.2 26.3,22.2 v24.15,20.2 | X14.1 3.7,74.94 5.2,73.44 5.2,72.2 5.9,71.5 12.95,71.5 13.75,72.3 21.65,72.3 22.45,71.5 27,71.5 27.4,71.1 27.4,66.95 27.35,66.9
  Bottom 0.2: 49.65,30.11 48.2,29 48,28.5 arc64 48.75,26 | 19.8,21.85 21.55,21.85
  Bottom 0.25: X14.1 5.21,74.94 R1.1 | N2.3 v48.9,39.1 | v40.7,21.5 41.45,20.45 48.9,20.45 48.9,25.85 48.75,26 | 49.65,30.11 v50.3,30.55 | D4.13 23.9,18.42 23.9,19.9 24.15,20.15 v24.15,20.2 23.05,21.3 23.05,21.65 22.65,22.05 21.75,22.05 21.55,21.85 | v22,31.6 22,25.75 19.65,23.4 19.65,22 19.8,21.85
C_RX  (via drill 0.5)
  Top 0.25: A1.43 16.52,66.42 16.9,66.8 v19.55,66.8 19.9,66.45 20.95,66.45 21.55,67.05 23.35,67.05 23.65,67.35 25.15,67.35 25.3,67.5 25.3,69.15 24.2,70.25 20.15,70.25 19.8,69.9 R22.1
  Bottom 0.25: v19.55,66.8 19.9,66.8 20.3,66.4 20.3,64.96 D2.12
C_TX  (via drill 0.5)
  Top 0.25: A1.44 14.52,66.12 15.7,67.4 15.95,67.65 20.15,67.65 v20.6,67.4 20.75,67.55 22.9,67.55 23.15,67.8 23.15,68.8 22.25,69.7 20.5,69.7 19.95,69.15 16.75,69.15 16.55,69.35 R21.1
  Bottom 0.25: v20.6,67.4 21.5,66.5 21.5,65.03 D2.11
EXT_DM
  Bottom 0.2: X20.1 4.41,26.1 2.7,26.1 2.5,25.9 2.5,17.2 8.8,10.9 18.75,10.9 18.9,10.75 20.6,9.05 20.6,6.25 22.25,4.6 23.6,4.6 25.2,6.2 29.9,6.2 30.41,5.69 X9.2
EXT_DP
  Bottom 0.2: X20.2 2.1,26.33 2.1,17 8.6,10.5 18.55,10.5 20.2,8.85 20.2,6 22,4.2 23.8,4.2 25.4,5.8 29.6,5.8 29.76,5.64 X9.3
EXTAL
  Bottom 0.25: D1.33 24.35,57.45 23.3,58.55 19.4,58.55 19.3,58.4 19.3,57.5 G1.1
FEEDBACK
  Bottom 0.2: 44.2,39.1 44.1,39 42.4,39 42.3,39.1 42.3,41.05 41.95,41.25 41.95,42.15 42.3,42.55
  Bottom 0.25: R16.1 43.95,42.9 R17.2 42.65,42.9 42.3,42.55 | N2.8 44.2,39.1
GND  (via drill 0.5)
  Top 0.25: A1.25 48.65,56.95 arc90 50,58.3 51.7,58.3 arc90 53.9,60.5 53.9,74.08 arc-90 X1.5 | A1.27 48.75,60.95 arc-90 50.1,59.6 51.6,59.6 arc90 52.5,60.5 52.5,74.44 arc90 X1.2 | A1.49 10.52,48.38 10.5,48.4 | A1.46 10.55,60.95 10.6,61 | 12.5,64.83 A1.45 12.52,63.72 12.5,63.4 | 18.5,64.83 A1.42 | 46.62,64.8 A1.28
  Top 0.5: A1.46 A1.48 | 10.6,61 10.6,61.8 12.5,63.4 | 12.5,63.4 12.5,64.83 | 12.5,63.4 18.5,63.4 18.5,64.83 | A1.45 12.52,65.87 v13.25,66.45 | A1.27 48.42,60.92 48.75,60.9 48.75,64.2 47.8,64.8 46.62,64.8 | 38.62,64.8 A1.32 38.6,64.82 | A1.34 34.52,63.58 34.8,63.3 38.3,63.3 38.6,63.6 38.6,64.82 | 38.6,64.82 v38.6,66.9 | A1.7 24.57,35.33 v24.6,35.3 | A1.28 A1.29 A1.30 A1.31 | v9.2,57.95 10.5,57.95 | 48.3,47 46.8,47 v46.2,46.45
  Top 0.75: A1.31 40.57,66.87 v40.6,66.9
  Bottom 0.2: N1.5 46.09,29.15 46.85,29.05 47.1,28.7 47.3,28.7 arc19 47.65,26.9 47.8,26.5 arc-25 v48.1,24.4 | D3.25 12.65,38.05 12.85,38.25 12.85,38.3 12.95,38.4 12.95,38.6 14.55,40.2 18.5,40.2 18.65,40.35 18.65,41.35 v18.6,41.4 | D3.17 16.75,37.8 | N1.2 45.2,30.66 | 45.2,30.66 44.79,30.66 N1.25 | N1.24 45.24,30.71 45.2,30.66 | v24.45,28.7 v27.7,28.7
  Bottom 0.25: C2.2 48.35,74.42 A2.1 | 42.91,30.51 42.76,30.66 N1.17 | 42.91,30.51 N1.25 43.7,29.73 43.7,29.2 43.76,29.14 N1.5 46.41,29.14 | 42.91,30.51 42.55,30.15 N1.16 41.1,30.15 40.6,30.15 40.5,30.05 40.5,29.15 C18.2 41,29.65 N1.15 42.65,29.65 42.8,29.5 | C25.2 24.1,42 24.35,41.65 26.65,41.65 26.7,41.9 C26.2 26.7,41.7 26.9,41.5 v28,41.5 | C3.2 17.7,46 18.25,45.5 | 18.25,45.5 D3.47 | D1.16 D1.15 25.85,46.05 v25,45.15 | C23.2 32.65,61.65 32.4,61.5 32.4,59.45 33,58.85 D1.47 | C22.2 32.75,42.6 32.2,42.6 31.95,42.8 31.9,42.85 31.9,44.95 32,45.05 D1.4 | D1.31 24.8,55 25.1,55.4 25.1,55.5 v25.3,56 | C24.2 19.1,48 v19,47.9 19,46.3 18.25,45.5 | C16.2 47.85,24.75 v48.1,24.4 48.15,24.4 R19.1 | v39.2,30.15 40.4,29.1 | 50.4,32.6 50.45,32.65 C19.2 51.3,32.6 51.5,32.4 v51.5,30.8 | v13.25,66.45 16.1,66.45 16.4,66.2 16.4,65.05 D2.15 | C9.1 C8.1 27.45,14.75 v27.45,16.05 | 30.15,77.2 R15.2 | C27.2 12.25,76.55 11.8,77 11.8,79.35 X7.3 | C28.2 50.7,40.27 | 46.7,39.5 N2.11 | C30.2 40.35,39.65 40.4,39.7 40.95,39.7 C29.2 | D5.7 D5.6 D5.5 42.45,71.15 41.8,70.5 | C31.2 43.65,68.65 42.9,67.9 42.9,67.08 D5.4 42.88,67.1 42.1,67.1 41.8,67.4 41.3,66.9 v40.6,66.9 | C34.2 38.95,60.75 | 38.95,60.75 39.1,60.6 D6.P7 | D6.P11 42.6,62.4 42.5,62.5 41.9,62.5 41.8,62.4 | D6.P10 41.8,62.4 | 41.8,62.4 41.7,62.5 39.8,62.5 39.4,62.1 39.4,61.2 38.95,60.75 | 32.8,42.75 32.8,41.5 32.6,41.3 v31.9,41.1 | v18.5,35.5 17.4,35.5 17.4,35.6 16.75,36.25 D3.17 | D3.5 18.75,41.55 v18.6,41.4 | 46.3,40.85 v46.45,41 | R5.1 27.5,27.45 27.7,27.65 v27.7,28.7 | D4.15 23.23,27.48 v24.45,28.7 | C7.2 v22.15,21.2 23.23,20.12 D4.14 | C6.2 R4.1 36.5,18.8 v37.55,19.8
  Bottom 0.3: X9.5 28.46,2.4 X9.Z3
  Bottom 0.4: C23.2 v33.3,63.05 | N2.11 46.3,40.85 | v46.45,41 47,41
  Bottom 0.5: C18.2 40.4,29.1 | X16.1 41.1,24.3 41.4,24.6 42.45,24.6 C17.2 | C12.2 C13.2 27.45,68.45 27.5,68.5 28.4,68.5 v28.5,68.4 28.4,68.4 | 30.15,77.2 29.2,77.2 28.85,76.85 V1.2 | 50.7,40.27 49,41 47,41 | C28.2 52.75,40.05 53.5,39.3 53.5,37.5 54.17,36.83 X6.15 | v31.9,77.2 30.2,77.2 | C35.2 28.4,29.4 v27.7,28.7
  Bottom 0.75: X2.13 16.59,21.81 17,21.4 17,20.45 C4.2 | C5.2 54.95,21.15 54.6,21.5 X4.13 | C20.2 C14.2 C15.2 47.45,35.85 v48.1,36.5
  other vias: 18.8,28.2 6.7,43.3 32.1,50.8 40,39.8 27.7,21 40.3,52.7 27.7,23.65 54.35,28.4 50.85,35.25 54.3,25.85 39.7,35.5 45.6,62.3 28.3,52.6 26.95,51.7 21,34.1 20,33.7 13.9,30.3 16.3,47.5 41.25,44.75 39.7,45.8 39.7,43.2 10.5,48.35 36.1,32.8 49.3,64.75 51.15,64.9 50.4,63.35 54.35,58.25 54.7,60.9 54.45,68.6 51.85,72.05 54.45,71.05 40.75,63.05 39.7,57.8 16.9,55.95 6.5,61.05 4.4,61.05 35.9,14.35 7.5,38.35 7.15,20.3 52.35,33.1 47.25,32.4
  pour Bottom: 0,0 59,0 59,84 0,84
  pour Top: 0,0 59,0 59,84 0,84
HUB_V33
  Bottom 0.2: C6.1 35,20 35,17.9
  Bottom 0.25: D4.17 D4.16 23.88,24.3 | 35,17.9 32.08,17.9 D4.1 | C7.1 23.1,22.5 | 23.1,22.5 25.85,19.75 25.82,19.73 D4.10 25.85,18.42 25.85,19.6 25.95,19.7 28.9,19.7 29.05,19.55 29.05,18.42 D4.5 29.07,19.62 29.5,20.05 34.35,20.05 C6.1 | 23.88,24.3 23.88,23.27 23.1,22.5 | D4.24 29.07,24.77 28.9,24.6 24.18,24.6 23.88,24.3
K20_V33  (via drill 0.5)
  Top 0.2: 28.1,51.7 28.05,51.7 v25.3,54.4
  Top 0.25: v31.5,47.8 30.15,49.2 v30.15,51.7 28.1,51.7 26.1,49.7 v22.5,49.7
  Bottom 0.2: D1.30 25.2,54.5 v25.3,54.4
  Bottom 0.25: R14.1 29.45,42.75 30.5,43.8 D1.7 30.5,46.9 30.6,47.05 31.5,47.05 | 31.5,47.05 32.3,47.05 32.5,46.8 D1.3 32.5,44.55 C22.1 | v30.15,51.7 33.1,54.65 33.1,56.3 33.5,56.7 D1.48 33.5,59.1 33.3,59.3 C23.1 | v31.5,47.8 31.5,47.05 | D1.21 22.7,50 v22.5,49.7
K20_VDDA
  Bottom 0.25: D1.13 27.5,44.75 | 27.5,44.75 R14.2 | 27.5,44.75 C26.1 26.65,44.2 26.1,44.2 26,44 26,42.6 25.75,42.45 R13.2
K20_VREF
  Bottom 0.25: D1.14 27,45.2 26.85,45.05 26.05,45.05 25.2,44.2 R13.1 C25.1
LED_ETH0  (via drill 0.5)
  Top 0.2: 45.6,29.25 50.48,24.3
  Top 0.25: A1.39 24.6,64.82 24.6,58.9 26.6,56.8 26.6,54.55 27.15,54.1 37.8,54.1 39,52.9 39,46.8 37.8,45.6 37.8,42.2 38.5,41.5 38.5,39.3 39.1,38.7 41,38.7 41.5,38.2 41.5,33.9 45.6,29.8 45.6,29.25 | 50.48,24.3 54.25,24.3 v54.5,24.6
  Bottom 0.25: R3.2 54.65,24.4 v54.5,24.6
LED_ETH1  (via drill 0.5)
  Top 0.25: v16.3,26.8 21.1,26.8 29.5,35.2 29.5,38 30.2,38.7 31.8,38.7 32.8,39.4 34.45,39.4 35.45,40.35 35.45,42.35 35.7,42.6 35.75,42.6 35.75,43.65 35.9,43.9 35.9,45.05 35.7,45.25 35.7,52.6 34.8,53.5 26.95,53.5 26.1,54.25 26.1,56.4 23.6,59 23.6,65.8 24,66.2 26.2,66.2 26.5,65.9 26.5,64.92 A1.38
  Bottom 0.25: R2.2 16.05,26.55 v16.3,26.8
LED_WLAN  (via drill 0.5)
  Top 0.25: v20.85,31.55 16.65,31.55 15.45,32.75 15.45,38.35 14.75,39.05 14.3,39.05 14.25,39.1 14.25,39.15 14.05,39.35 14.05,42.3 14.45,42.7 16.3,42.7 16.65,43.05 17.1,43.05 19.55,45.5 19.55,47 19.9,47.35 19.9,48.6 19.6,48.9 19.6,50.7 20.25,51.35 21.15,51.35 21.8,52 21.8,62.2 20.55,63.45 20.55,64.83 A1.41
  Bottom 0.25: H2.C v20.85,31.55
N$1
  Bottom 0.25: D3.38 13.75,47.55 17.2,51 D1.23
N$2
  Bottom 0.25: D1.25 16.8,52 12.6,47.8 12.6,45.2 11.2,43.8 11.2,42.55 | 11.2,42.55 D3.34 12.1,42.55 | D3.33 11.45,42.05 11.2,42.3 11.2,42.55
N$3
  Top 0.25: A1.26 arc-90 48.47,59 | 53.3,78.38 arc-90 X1.1
  Top 0.5: 48.47,59 51.8,59 arc90 53.3,60.5 53.3,78.38
  Bottom 0.5: R20.1 53.32,78.6 X1.1
N$4
  Bottom 0.25: D4.6 28.43,17.32 28.95,16.8 28.95,15.7 | 28.95,15.7 28.95,14.75 C8.2 | G2.3 28.95,15.7
N$5
  Bottom 0.2: 28.2,15.5 28.2,13.55 C9.2
  Bottom 0.25: G2.1 33.6,13.6 33.6,13.1 33,12.3 30.2,12.3 28.82,13.53 C9.2 | D4.7 27.77,17.23 28.45,16.55 28.45,15.75 28.2,15.5
N$6
  Bottom 0.5: R20.2 45.5,78.6 44.5,79.6 E1.FB
N$8  (via drill 0.5)
  Top 0.25: v20.4,50.15 20.4,45.1 v16.85,41.55
  Bottom 0.25: D3.32 16.35,41.55 v16.85,41.55 | D1.22 20.75,50.5 v20.4,50.15
N$9
  Bottom 0.25: D3.37 13.25,47.75 17,51.5 D1.24
N$10
  Bottom 0.25: D3.8 20.55,40.05 22.2,41.75 22.2,44.95 25.6,48.35 25.6,52.6 28.2,55.2 28.2,56.2 27.9,56.4 26.6,56.4 26.5,56.5 D1.34
N$11
  Bottom 0.25: D3.18 16.25,35.6 C1.1
N$13
  Bottom 0.25: X2.14 14.05,24.7 R2.1
N$15
  Bottom 0.25: R3.1 57.05,23.85 57,23.8 57,23.7 56.9,23.6 55.2,23.6 55,23.8 53.06,23.8 X4.14
N$16
  Bottom 0.25: H2.A R23.2
N$17
  Bottom 0.25: D4.18 25.18,27.38 R5.2
N$18
  Bottom 0.25: D2.6 21.6,69.8 21.8,69.6 25.2,69.6 25.5,69.3 C12.1
N$19
  Bottom 0.25: D2.2 16.5,71.05 16.5,69.8 16.6,69.7 20.9,69.7 21.5,69.15 24.6,69.15 24.85,68.9 25.05,68.9 C13.1
N$20
  Bottom 0.25: C10.1 15.6,75.75 15.6,74.9 15.05,74.35 15.05,72.65 15.25,72.45 D2.1
N$21
  Bottom 0.25: D2.3 17.8,72.5 17.6,72.7 17.6,74.8 17.4,75 17.4,75.35 C10.2
N$22
  Bottom 0.2: 20.8,75 20.29,74.53 20.29,72.27 20.35,72.2 20.35,71.09 D2.5
  Bottom 0.25: 20.8,75 20.8,75.75 C11.1
N$23
  Bottom 0.2: 19.4,72.3 19.88,72.8 19.88,74.7 19.6,75
  Bottom 0.25: D2.4 19.07,72.27 19.1,72.3 19.4,72.3 | 19.6,75 19.6,75.75 C11.2
N$24
  Bottom 0.25: X8.1 14.46,77.34 15,76.8 21.9,76.8 22.6,76.1 22.6,72.6 22.9,72.3 22.9,71.1 D2.7
N$25
  Bottom 0.25: X8.2 17,77.8 17.6,77.3 24,77.3 25.1,76.2 25.1,71.3 24.8,71 24.22,71 D2.8
N$26  (via drill 0.5)
  Top 0.25: v10.75,66.1 11.1,66.12 13.12,68.65 13.18,68.7 20.25,68.7 20.75,69.25 21.6,69.25 22.35,68.45 v22.35,68.35
  Bottom 0.25: v22.35,68.35 23.85,68.2 24.2,67.8 24.2,64.98 D2.9 | R6.2 v10.75,66.1
N$27  (via drill 0.5)
  Top 0.25: X4.16 42.3,22.8 42.3,24.3 41.8,25.6 40.5,25.6 33.2,32.1 v33.2,34.4
  Bottom 0.25: R7.1 v33.2,34.4
N$28
  Bottom 0.25: R8.1 4.45,24.03 X2.16
N$30
  Bottom 0.25: N1.20 43.24,32.36 43.05,32.65 42.05,32.65 41.75,33 C20.1
N$32
  Bottom 0.25: N1.23 44.76,32.66 44.8,32.7 45.95,32.7 46.5,33.25 48.05,33.25 C19.1 48.6,32.7
N$34
  Bottom 0.25: N1.19 41.82,31.88 40.6,33.1 40.05,33.1 C21.2
N$35
  Bottom 0.25: D1.17 C24.1
N$37
  Bottom 0.25: 40.9,31.1 40.95,31.14 N1.18 | C21.1 40,31.1
  Bottom 0.5: 40.9,31.1 40,31.1 38.15,31.1 L1.A
N$38
  Bottom 0.25: H1.C 44.1,26.6 44.76,27.26 N1.8
N$39
  Bottom 0.25: R9.2 44.75,24.35 44.7,24.4 44.7,24.6 44.6,24.7 44.15,24.7 H1.A
N$57  (via drill 0.5)
  Top 0.5: v23.7,78.7 22.8,78.7 20,75.9 13.63,75.9 A2.16
  Bottom 0.5: V1.3 24.6,77.8 v23.7,78.7
N$59
  Bottom 0.25: C34.1 38.45,58.85 39.2,59.6 D6.P6
N$60
  Bottom 0.25: D6.P13 44.2,62.3 44.5,62.6 44.5,63.25 C33.2
N$61
  Bottom 0.25: 43.3,63.1 43.25,63.15 C33.1 43.2,63.25 43.2,62.5 43.4,62.3 D6.P12
RDM0
  Top 0.2: A1.13 36.55,37.03 36.55,36.05 36.05,35.55 36.05,35.05 43.3,27.8 48,23.35 48,19.89 47.99,19.89 47.1,19 47.1,17.73 X4.4
RDM1
  Top 0.2: A1.9 28.55,37.02 28.55,36.05 28.25,35.75 27.75,35.75 27.5,35.5 27.5,34.8 22.7,29.75 17,29.75 9.9,22.9 9,22 9,17.84 X2.4
RDP0
  Top 0.2: A1.12 34.52,35.98 43.2,27.3 47.6,23.15 47.6,20.1 46.65,19.15 46.65,18.5 X4.5
RDP1
  Top 0.2: A1.8 26.55,37.03 26.55,36.05 27.1,35.5 27.1,35 26.57,34.47 22.5,30.15 16.8,30.15 9.5,23.1 8.6,22.2 8.6,18.5 X2.5
RS232RX  (via drill 0.5)
  Top 0.25: R22.2 18.25,71.6 18.1,71.75 14.1,71.75 v13.6,70.95
  Bottom 0.25: X7.2 9.4,75.9 8.5,75.1 8.5,73 9.8,71.7 11.85,71.7 12.97,70.58 | D2.13 19,64.99 19,66.2 17.7,67.55 15.05,67.55 15.05,68.5 12.97,70.58 | v13.6,70.95 13.35,70.95 12.97,70.58
RS232TX  (via drill 0.5)
  Top 0.25: R21.2 14.65,71 14.45,70.8 14.45,70.6 13.8,69.95 12.95,69.95 11.85,71.05 8.7,71.05 v8.35,70.7
  Bottom 0.25: X7.1 6.86,74.04 9.46,71.35 | 9.46,71.35 9.6,71.2 11.7,71.2 14.5,68.4 14.5,67.35 14.85,67 17,67 17.8,66.2 D2.14 | v8.35,70.7 8.81,70.7 9.46,71.35
SS
  Bottom 0.2: N2.7 41.66,38.59
  Bottom 0.25: 41.66,38.59 C30.1
T_RESET_L  (via drill 0.5)
  Top 0.25: v6.2,35.7 5.5,36.4 5.5,67.7 4.6,68.5 1.6,68.5 1.1,68.9 1.1,75.6 3,77.5 X10.1
  Bottom 0.25: v6.2,35.7 14.8,35.7 15.25,35.9 D3.20
TDM0
  Top 0.2: A1.15 40.57,33.63 49.6,24.6 49.6,21.1 50.75,19.95 50.75,18.14 X4.2
TDM1
  Top 0.2: 32.52,36.32 26.5,30.3 26.5,28.4 20.4,22.25 19.95,22.25 17.5,19.8 13.9,19.8 13.1,19 13.1,17.8 X2.2
  Top 0.25: A1.11 32.52,36.32
TDP0
  Top 0.2: A1.14 38.57,35.43 39.4,34.6 39.4,34.2 49.2,24.4 49.2,20.9 50.3,19.8 50.3,18.14 X4.3
TDP1
  Top 0.2: A1.10 30.55,37.02 30.55,36.05 30.7,35.9 30.95,35.9 31.1,35.75 31.1,35.5 30.5,34.9 26.05,30.5 26.05,28.55 20.15,22.7 19.8,22.7 17.3,20.2 13.7,20.2 12.65,19.15 12.65,18.23 X2.3
  Top 0.25: A1.10 30.52,36.82 30.5,36.8
TEENSY_DM
  Bottom 0.2: X20.3 4.47,28.8 2.6,28.8 1.4,30 1.4,33.7 2.4,34.7 19.1,34.7 22.97,38.57 22.97,40.37 23.3,40.7 29.55,40.7 31,42.15 D1.6
TEENSY_DP
  Bottom 0.2: X20.4 2,30 1.8,30.2 1.8,33.5 2.6,34.3 19.3,34.3 23.4,38.4 23.4,40.15 23.5,40.3 29.75,40.3 31.45,42 31.45,45.05 31.5,45.2 D1.5
TG0
  Bottom 0.25: D1.39 29,60.5 28.5,61 16,61 7.07,52.07 X5.7 3.01,52.1 1.4,52.1 1.1,52.4 1.1,65.5 1.3,65.7 1.3,65.8 1.5,66 6.8,66 R6.1
TG1  (via drill 0.5)
  Top 0.25: v21.15,68.45 20.85,68.2 13.38,68.2 11.35,65.55 11.4,64.3 9.3,62.2 9.2,62.2 8.5,61.5 8.5,58.7 8.3,58.35 v8.3,55.8
  Bottom 0.25: X5.8 8.5,54.61 | 8.5,54.61 8.61,54.61 15.5,61.5 29,61.5 29.5,61 D1.40 | D2.10 22.88,66.22 v21.15,68.45 | v8.3,55.8 8.3,54.91 8.5,54.61
TG2
  Bottom 0.25: D1.57 44,51.5 54.73,62.23 X6.5
TG3
  Bottom 0.25: X5.1 4.33,36.83 9.5,42 9.5,48.5 14.5,53.5 D1.28
TG4
  Bottom 0.25: X5.2 5.87,39.37 9,42.5 9,49 14,54 D1.29
TG5
  Bottom 0.25: D1.64 47.9,48 49.25,46.65 53.55,46.65 54.3,45.9 54.3,44.7 54.5,44.5 56.33,44.5 X6.12
TG6
  Bottom 0.25: D1.61 47,49.5 49.57,52.07 X6.9
TG7
  Bottom 0.25: D1.59 46,50.5 52.65,57.15 X6.7
TG8  (via drill 0.5)
  Top 0.25: v33,68.2 33,69.87 A2.6
  Bottom 0.25: v33,68.2 33.6,68.2 34.3,67.5 34.3,56.8 33.6,56.1 33.6,50.7 34.3,50 D1.60 46.5,50 51.11,54.61 X6.8
TG9
  Bottom 0.25: X5.12 5.73,64.77 7,63.5 31.35,63.5 | 31.35,63.5 31.35,59.85 32.5,58.7 D1.46 | A2.7 34.06,73.64 33,74.7 30.8,74.7 30.2,74.1 30.2,64.8 31.35,63.5
TG10
  Bottom 0.25: D1.49 36.7,55.5 | 36.7,55.5 44.45,55.5 52.3,63.4 52.3,70.85 53.9,72.4 54.11,72.39 X6.1 | A2.10 26.5,73.53 26.5,75.1 27.1,75.7 37.2,75.7 37.9,75 37.9,71.8 35.8,69.65 35.8,56.4 36.7,55.5
TG11
  Bottom 0.2: 34.8,67.85 34.8,56.6 34.05,55.9 34.05,54.75
  Bottom 0.25: A2.8 31.52,70.98 34.8,67.85 | 34.05,54.75 34.3,54.5 D1.51 45,54.5 54,63.4 54,66.75 54.56,67.31 X6.3
TG12
  Bottom 0.25: D1.52 45.5,54 54.6,63.2 54.6,64.4 54.97,64.77 X6.4
TG13
  Bottom 0.2: 35.3,56.5 34.5,55.75 34.5,55.05
  Bottom 0.25: A2.9 28.98,74.58 29.6,75.2 34.6,75.2 35.3,74.5 35.3,56.5 | 34.5,55.05 34.65,55 D1.50 44.7,55 52.8,63.05 52.8,69.05 53.85,69.85 X6.2
TG14
  Bottom 0.25: D1.58 45.5,51 54.19,59.69 X6.6
TG15
  Bottom 0.25: X5.9 10.15,57.15 15,62 29.5,62 30,61.5 30,59.25 31,58.25 D1.43
TG16
  Bottom 0.25: X5.3 7.41,41.91 8.5,43 8.5,49.5 18,59 26.5,59 27,58.5 D1.35
TG17
  Bottom 0.25: X5.4 7.45,44.45 8,45 8,50 17.5,59.5 27,59.5 27.5,59 D1.36
TG18  (via drill 0.5)
  Top 0.25: v49.15,30.8 48.95,31.1 47.3,31.1 44.3,34 44.3,34.6 44.8,35.05 49,35.05 52.9,38.9 v52.9,42 | v42,57.8 v42,47.2 42,47
  Bottom 0.2: 41.9,47.3 v42,47.2
  Bottom 0.25: X5.6 6.53,49.53 7,50 7,51 16.5,60.5 28,60.5 28.5,60 D1.38 28.5,56.55 28.75,56.3 28.75,55 26.15,52.4 26.15,48.15 | D3.9 20.7,39.55 22.7,41.6 22.7,44.75 26.15,48.15 | N1.4 46.65,29.65 46.8,29.5 47.62,29.5 v49.15,30.8 | 26.15,48.15 29.75,48.15 29.95,48.35 29.95,48.65 30.65,49.35 32.65,49.35 34.7,47.3 38.4,47.3 | v52.9,42 52.9,44.2 51,46.1 48.3,46.1 47.1,47.3 42.3,47.3 v42,47.2 | R11.1 38.4,47.3 | D5.1 44.88,65.03 47,62.9 47,58.8 45.5,57.3 42.5,57.3 v42,57.8 42.6,58.4 D6.P3 | 38.4,47.3 41.9,47.3
TG19  (via drill 0.5)
  Top 0.25: v47.35,30.3 46.8,30.8 46.5,30.8 43.2,34 43.2,34.9 43.7,35.5 48.5,35.5 51.9,38.9 v51.9,42.8 | v44,58.2 v44,46.5
  Bottom 0.2: 39.2,46.45 37.15,46.45
  Bottom 0.25: D1.37 28,59.5 27.5,60 17,60 7.5,50.5 7.5,47.5 6.99,46.99 X5.5 2.83,47.2 2.3,47.2 1.1,46 1.1,36.4 1.8,35.7 4.4,35.7 5.5,36.8 12.1,36.8 14.3,39.05 D3.10 20.9,39.05 23.2,41.45 23.2,44.5 26.1,47.4 29.9,47.4 30.4,47.9 30.4,48.45 30.85,48.9 32.3,48.9 35.7,45.5 37.4,45.5 R12.1 37.15,46.45 | v51.9,42.8 51.9,44.3 50.7,45.5 43.4,45.5 | N1.3 47.35,30.15 v47.35,30.3 | D5.2 44.23,64.97 46.5,62.65 46.5,59.05 45.2,57.75 44.45,57.75 v44,58.2 43.7,58.5 43.7,58.4 43.5,58.6 43.5,59.5 D6.P2 | 43.4,45.5 43.4,45.9 v44,46.5 | 43.4,45.5 42.5,46.35 40.6,46.35 40.1,46.7 39.5,46.7 39.2,46.45
TG20
  Bottom 0.25: D1.62 47.5,49 48.03,49.53 X6.10
TG21
  Bottom 0.25: D1.63 52.95,48.5 54.46,46.99 X6.11
TG22
  Bottom 0.25: X5.10 11.69,59.69 14.5,62.5 29.9,62.5 30.45,61.95 30.45,59.45 31.5,58.4 D1.44
TG23
  Bottom 0.25: X5.11 13.23,62.23 14,63 30.1,63 30.9,62.2 30.9,59.65 32,58.55 D1.45
TGI24  (via drill 0.5)
  Top 0.25: v27.4,55.6 34.6,55.6 34.6,60.8 36.2,62.4 38.7,62.4 39.4,63.1 39.4,71 40.45,72.05 40.45,75.85 37.7,78.6 v33.2,78.6
  Bottom 0.25: V1.1 29.15,78.75 29.3,78.6 30.15,78.6 R15.1 | D1.27 25.05,53 27.4,55.3 v27.4,55.6 | 30.25,78.6 R15.1 | v33.2,78.6 31.3,78.6 31.2,78.5 30.25,78.5 R15.1
TGI25  (via drill 0.5)
  Top 0.25: v27.35,49 23.2,44.95 23.2,38.4 23.6,38 23.6,32.05 22.35,30.7 16.75,30.7 10.45,24.7 v8.8,24.7
  Bottom 0.25: D1.42 30.5,53.2 28.5,51.2 28.5,50.1 v27.35,49 | v8.8,24.7 5.85,24.7 R8.2
TGI26
  Bottom 0.25: D1.2 33,45.25 33.3,44.95 33.55,44.95 33.65,44.9 33.65,41.2 33.2,40.75 R7.2
TGI30  (via drill 0.5)
  Top 0.25: v45.5,26.85 45.6,27.2 37.6,35.2 v37.6,41.2 37.2,41.2 v37.2,52.4
  Bottom 0.25: N1.7 45.24,27.36 v45.5,26.85 | D1.56 36.8,52 v37.2,52.4 | v37.6,41.2 37.6,42.35 R10.1
TGI31  (via drill 0.5)
  Top 0.25: X4.15 44.8,22.84 44.8,24 42.4,26.4 40.9,26.4 34.4,32.9 34.4,34.6 v34.5,34.7
  Bottom 0.25: v34.5,34.7 34.4,34.8 34.4,37.2 34.2,37.4 34.2,45.7 33.85,46.05 D1.1
TGI33  (via drill 0.5)
  Top 0.25: X2.15 6.95,25.05 8.2,26.3 8.15,37.05 v9.1,37.9
  Bottom 0.25: v9.1,37.9 9.1,39.5 10.7,41.1 10.7,46.7 16.6,52.6 20.7,52.6 20.8,52.5 D1.26
TSENS
  Bottom 0.2: X17.1 38.5,23.5 39.85,22.4 40.95,22.4 42.15,21.3 43.65,21.3 | 43.65,21.3 46.25,21.3 R18.1 | N1.9 44.25,27.4 43.4,26.7 43.4,23.75 43.65,23.55 43.65,21.3
  Bottom 0.25: R18.1 46.3,22 R19.2
USB_5V  (via drill 0.5)
  Top 0.4: X3.1 25.07,9.43 23.45,11.05 20.05,11.05 18.45,9.45 16,9.45 v15.75,9.7 | v53.45,33.6 53.51,33.51 53.39,33.51 54.93,35.3 55,35.3 55.3,35.6 57.35,35.6 58.05,36.25 58.05,40.8 56.94,41.91 X6.13 | X5.13 1.71,67.31 0.95,66.55 0.95,19.5 5.45,15 5.45,9.76 X2.U1
  Top 0.75: v37.5,15.3 v37.5,17.4
  Bottom 0.25: N1.22 44.25,33.25 44.4,33.2
  Bottom 0.35: 44.4,33.2 45.7,33.2 C15.1
  Bottom 0.4: X9.1 31.06,6.94 | v15.75,9.7 8.48,9.7 X2.U1
  Bottom 0.5: 31.06,6.94 29.8,8.2 27.1,8.2 26.8,8.5 26.8,8.85 X3.1 | X4.U1 40.39,8.21 37.5,11.1 | 33.39,11.1 X3.5
  Bottom 0.7: 51.4,34.15 52.95,34.15 v53.45,33.6 53.45,33.45 53.5,32.75 53.15,32.3 53.1,32.3
  Bottom 0.75: X3.5 32.73,10.93 32,10.2 32,7.88 31.06,6.94 | 33.39,11.1 37.5,11.1 v37.5,15.3 | v37.5,17.4 39.3,17.4 42,18.8 50.65,18.8 50.65,23.5 51.05,23.9 51.6,24.2 53.1,24.6 53.1,32.3 | C15.1 51.4,34.15
USBDM0  (via drill 0.5)
  Top 0.2: A1.21 49.65,44.95 50,44.6 v50,44.2
  Bottom 0.2: v50,44.2 42.7,44.2 38.3,39.8 38.3,35.3 38.2,35.1 38,34.9 36,34.9 33.3,32.2 33.3,27.45 32.75,26.9 32.75,25.1 32.55,24.9 32.55,24.5 31.55,23.5 30.75,23.5 29.75,24.5 29.75,25.68 D4.25
USBDM1
  Bottom 0.2: 5.91,32.4 31.25,32.4 31.7,32.05 31.7,27.3 31.02,26.62 D4.27
  Bottom 0.25: 5.91,32.4 X20.5
USBDM2
  Bottom 0.2: X4.U2 47.5,9.9 44.5,12.9 44.5,14.2 42.2,16.5 35.9,16.5 34.95,17.35 31.15,17.35 31,17.55 31,18.37 D4.2
  Bottom 0.25: X4.U2
USBDM3
  Top 0.2: X3.6 30.53,10.93 30.3,10.7 30.34,10.75 X3.2
  Bottom 0.2: X3.6 28.85,12.7 26.9,12.7 26.4,13.2 26.4,16.55 27.1,17.25 27.1,18.32 D4.8
USBDM4  (via drill 0.5)
  Top 0.2: 9.49,8.6 10.4,9.5 v10.4,12.4
  Top 0.25: X2.U2 9.49,8.6
  Bottom 0.2: v10.4,12.4 12.5,13.6 15.9,13.6 18.85,16.55 24.25,16.55 25.15,17.45 25.15,18.37 D4.11
USBDP0  (via drill 0.5)
  Top 0.2: 48.55,42.95 v50,43 | v33.6,26.4 33.6,25.45 32.45,24.3 v31.2,24.3
  Top 0.25: A1.20 48.55,42.95
  Bottom 0.2: v50,43 49.1,43.8 42.9,43.8 38.7,39.6 38.7,35 38.2,34.5 36.2,34.5 33.7,32 33.7,26.5 v33.6,26.4 | 30.4,25.73 D4.26 30.38,24.52 30.6,24.3 v31.2,24.3
USBDP1
  Bottom 0.2: X20.6 4.49,33.8 6.5,33.8 7.5,32.8 31.45,32.8 32.15,32.27 32.15,27.1 31.7,26.65 31.7,25.73 D4.28
USBDP2
  Bottom 0.2: X4.U3 48.2,6.9 46.9,6.9 46.4,7.4 46.4,10.4 44.1,12.7 44.1,14 42,16.1 35.7,16.1 34.75,16.95 30.8,16.95 30.4,17.4 30.4,18.37 D4.3
USBDP3
  Bottom 0.2: 28.7,10.95 28.7,12.1 28.4,12.3 26.7,12.3 26,13 26,16.75 26.45,17.2 26.45,18.37 D4.9 | 28.87,10.93 29,10.8 29.1,10.65 X3.3
  Bottom 0.25: 28.7,10.95 X3.7 28.87,10.93
USBDP4  (via drill 0.5)
  Top 0.2: 11.51,8.79 10.8,9.5 10.8,11.6 11.3,12.2 v11.3,14
  Top 0.25: X2.U3 11.51,8.79
  Bottom 0.2: v11.3,14 15.7,14 18.65,16.95 24.05,16.95 24.5,17.4 24.5,18.37 D4.12
USBREF
  Bottom 0.25: D4.4 29.73,19.38 29.8,19.5 33.1,19.5 33.65,18.8 R4.2
V_DRV
  Bottom 0.2: R18.2 47.6,21.75 47.5,21.85 47.5,23.4 46.05,23.4 46.05,25.55
  Bottom 0.25: N1.6 46.74,27.91 46.85,27.8 C16.1 46.7,26.25 46.1,26.25 46,26.15 46,25.7 45.95,25.65 | R9.1 45.95,25.65 | 46.05,25.55 45.95,25.65
VBATTERY
  Bottom 0.25: N1.12 42.76,27.25 42.5,27 42.5,26.8 | 42.5,26.8 C17.1 | N1.11 43.24,27.29 42.95,27.1 42.7,27 42.5,26.8
  Bottom 0.5: X15.1 37.21,25.71 41.65,25.7 42.25,26 C17.1
VDD  (via drill 0.5)
  Top 0.75: v11.1,31.2 11.1,36.4 10.4,37.1 10.4,40.83 A1.52 | X4.6 43.42,17.48 42.3,18.6 20.5,18.6 16.15,14.2 13,14.2 12,15.2 7.58,15.2 X2.6
  Bottom 0.75: X2.6 6.67,16 15.2,16 15.57,16.48 X2.1 15.57,18.62 15.4,18.8 | 15.4,18.8 14.3,19.9 13.7,19.9 12.5,21.1 12.5,25.8 13.1,26.4 13.1,29.2 v11.1,31.2 | X4.6 43.42,16.38 44.3,15.5 53.2,15.5 53.55,15.8 53.55,17.32 X4.1 53.65,17.43 C5.1 | C4.1 15.65,19.05 15.4,18.8
VSYS  (via drill 0.5)
  Top 0.25: 50.5,41.9 v50.7,41.7
  Top 0.4: v29.65,44.5 v35.05,44.5 | 50.5,41.9 47,41.9 46.7,42.2 46.7,43 45,44.7 42.8,44.7 42.5,45 v42.4,45 | v54,40.3 54,37.6 v52.55,36.15
  Top 0.5: v30.7,29.2 30.7,33.2 32.8,35.3 33.1,35.3 33.5,35.7 33.5,38.3 33.8,38.6 34.9,38.6 36.4,40.1 v36.4,41.9
  Bottom 0.25: 49.6,38.15 49.75,38.15 49.8,38.2 | D1.8 30,45 v29.65,44.5 | v50.7,41.7 51,41.7 | N2.1 N2.2 47.77,40.08 47.75,40.1 | N2.4 N2.5 | 50.91,38.11 C28.1 | 28.45,26.85 28.45,25.73 D4.23
  Bottom 0.3: N2.5 50.91,38.11 | 47.75,40.1 49.27,40.1 49.8,39.58 49.8,38.2
  Bottom 0.4: C28.1 49.75,38.15 | v35.05,44.5 35.05,41.95 37.3,40 | 37.3,40 37.7,40 41,43.25 42.4,44.65 v42.4,45 | 51,41.7 51.3,41.4 51.9,41.2 53.2,40.8 v54,40.3 | 37.3,40 36.4,40.9 36.4,40.95 36.4,41.2
  Bottom 0.5: v36.4,41.9 36.4,40.95 36.5,40.8 | 28.45,26.85 28.45,27.8 v30.7,29.2 29.7,30.2 C35.1
  Bottom 0.75: C28.1 50.95,36.6 51.25,36.3 52.4,36.3 v52.55,36.15 54.5,34.2 54.5,29.9 55.2,29.2 56.38,29.2 X19.1
VSYS_BQOUT  (via drill 0.5)
  Top 0.7: v52.05,25.7 v51.05,25.15
  Top 0.75: v52.05,25.7 53.67,26.97 55.15,26.95 X18.1
  Bottom 0.25: 40.05,26.9 C18.1 | 42,28.64 N1.13 N1.14 | 35.2,27.85 34.85,27.85 34.65,28.2 34.65,28.55 34.35,28.85 34.35,29.7 L1.B
  Bottom 0.5: C18.1 41.55,27.15 42,27.6 42,28.64 | 35.2,27.85 34.9,26.9
  Bottom 0.75: 34.9,26.9 40.05,26.9 | 50.55,24.9 v52.05,25.7 | 50.55,24.9 50.45,24.9 49.6,23.9 49.6,19.75 40.7,19.75 39.55,21 38.65,22 33.95,22 33.55,22.6 33.55,24.15 34.85,24.9 34.85,27.85 | 50.55,24.9 v51.05,25.15
X11  (via drill 0.5)
  Top 0.5: X13.1 55.41,34.26 53.3,32.15 51.6,32.15 49.55,34.2 v45.25,34.2
  Bottom 0.25: N1.21 43.75,33.25 43.8,33.3 C14.1
  Bottom 0.5: v45.25,34.2 43.85,34.2 C14.1
XTAL
  Bottom 0.25: D1.32 23.15,55.5 22.75,55.1 21.8,55.1 G1.3

### Text on the board
Top: CHAENOMELES
tPlace: 5IN | ON | KL/JC 2013
bPlace: V1.01 | WLAN
tNames: T | RESET | C | + | T | -